# EAGLE schematic hawks_rov_1_controller_v2 (EAGLE 8.6.1)

## Sheet 1 of 7
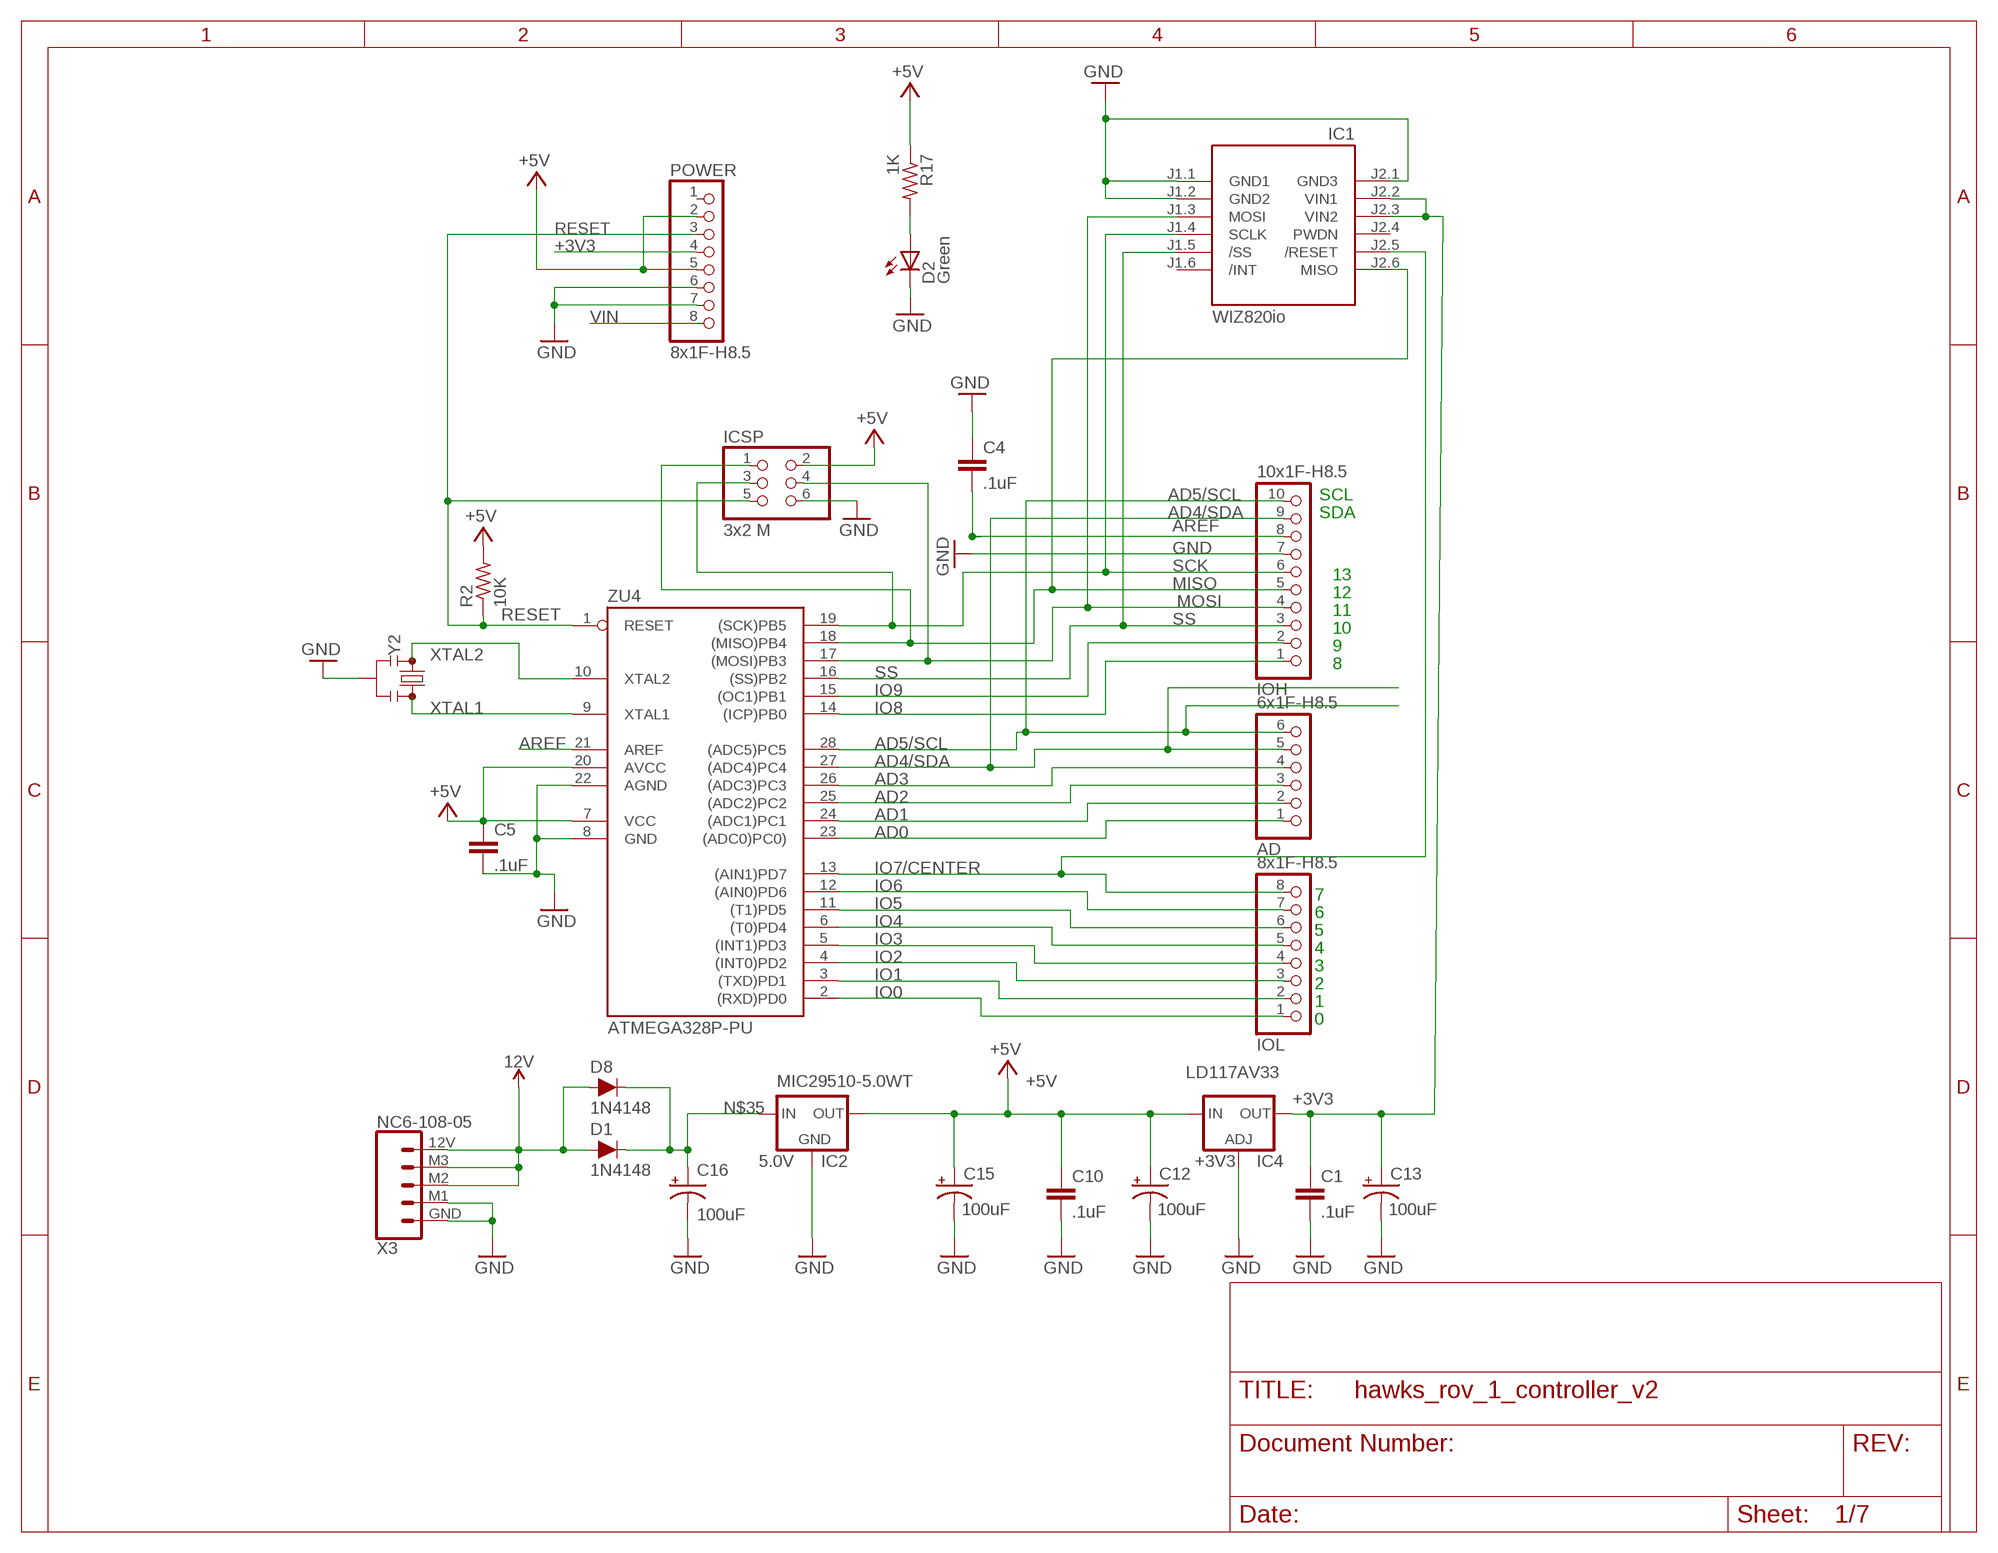
[diagram p0: schematic, sheet 1]

### Parts
AD  6x1F-H8.5  PINHD-1X6  [1X06]
C1  .1uF  10NF  [CAP-PTH-5MM]
C4  .1uF  10NF  [CAP-PTH-5MM]
C5  .1uF  10NF  [CAP-PTH-5MM]
C10  .1uF  10NF  [CAP-PTH-5MM]
C12  100uF  10UF-POLAR-RADIAL-2.5MM-25V-20%  [CPOL-RADIAL-2.5MM-5MM]
C13  100uF  10UF-POLAR-RADIAL-2.5MM-25V-20%  [CPOL-RADIAL-2.5MM-5MM]
C15  100uF  10UF-POLAR-RADIAL-2.5MM-25V-20%  [CPOL-RADIAL-2.5MM-5MM]
C16  100uF  10UF-POLAR-RADIAL-2.5MM-25V-20%  [CPOL-RADIAL-2.5MM-5MM]
D1  1N4148  DIODE-KIT  [DIODE-1N4148-KIT]
D2  Green  LED3MM  [LED3MM]
D8  1N4148  DIODE-KIT  [DIODE-1N4148-KIT]
IC1  WIZ820io  WIZ820IO_DEVICE'DUAL-IN-LINE'  [WIZ820IO]
IC4  LD117AV33  [TO220L1]
ICSP  3x2 M  PINHD-2X3  [2X03]
IOH  10x1F-H8.5  PINHD-1X10_ARD  [1X10]
IOL  8x1F-H8.5  PINHD-1X8  [1X08]
MIC29510-5.0WT  5.0V  MIC29510-5.0WT  [TO-220-STANDING]
POWER  8x1F-H8.5  PINHD-1X8  [1X08]
R2  10K  R-US_0207/10  [0207/10]
R17  1K  R-US_0207/10  [0207/10]
X3  NC6-108-05  [SCREWTERMINAL-3.5MM-5]
Y2  ZTT-16.00MX  [SIP3-UA]
ZU4  ATMEGA328P-PU  [DIL28-3]

### Nets
+3V3: C1.1 C13.1(+) IC1.J2.2(VIN1) IC1.J2.3(VIN2) IC4.2(OUT) POWER.4
+5V [usbvcc]: C5.1 C10.1 C12.1(+) C15.1(+) IC4.3(IN) ICSP.2 MIC29510-5.0WT.3(OUT) POWER.2 POWER.5 R2.2 R17.1 ZU4.7(VCC) ZU4.20(AVCC) ; also sheet 2,3,4,5,6,7
+12V: D1.A D8.A X3.12V X3.M2 X3.M3 ; supply symbol labelled 12V
AD0: AD.1 ZU4.23((ADC0)PC0))
AD1: AD.2 ZU4.24((ADC1)PC1)
AD2: AD.3 ZU4.25((ADC2)PC2)
AD3: AD.4 ZU4.26((ADC3)PC3)
AD4/SDA: AD.5 IOH.9 ZU4.27((ADC4)PC4) ; also sheet 2,3,4,5,6,7
AD5/SCL: AD.6 IOH.10 ZU4.28((ADC5)PC5) ; also sheet 2,3,4,5,6,7
AREF [aref]: C4.2 IOH.8 ZU4.21(AREF)
GND [gnd]: C1.2 C4.1 C5.2 C10.2 C12.2(-) C13.2(-) C15.2(-) C16.2(-) D2.K(C) IC1.J1.1(GND1) IC1.J1.2(GND2) IC1.J2.1(GND3) IC4.1(ADJ) ICSP.6 IOH.7 MIC29510-5.0WT.2(GND) POWER.6 POWER.7 X3.GND X3.M1 Y2.2 ZU4.8(GND) ZU4.22(AGND) ; also sheet 2,3,4,5,6,7
IO0: IOL.1 ZU4.2((RXD)PD0)
IO1: IOL.2 ZU4.3((TXD)PD1)
IO2: IOL.3 ZU4.4((INT0)PD2)
IO3: IOL.4 ZU4.5((INT1)PD3)
IO4: IOL.5 ZU4.6((T0)PD4)
IO5: IOL.6 ZU4.11((T1)PD5)
IO6: IOL.7 ZU4.12((AIN0)PD6)
IO7/CENTER: IC1.J2.5(/RESET) IOL.8 ZU4.13((AIN1)PD7)
IO8: IOH.1 ZU4.14((ICP)PB0)
IO9: IOH.2 ZU4.15((OC1)PB1)
MISO: IC1.J2.6(MISO) ICSP.1 IOH.5 ZU4.18((MISO)PB4)
MOSI: IC1.J1.3(MOSI) ICSP.4 IOH.4 ZU4.17((MOSI)PB3)
N$1: D2.A R17.2
N$35: C16.1(+) D1.C D8.C MIC29510-5.0WT.1(IN)
RESET: ICSP.5 POWER.3 R2.1 ZU4.1(RESET)
SCK: IC1.J1.4(SCLK) ICSP.3 IOH.6 ZU4.19((SCK)PB5)
SS: IC1.J1.5(/SS) IOH.3 ZU4.16((SS)PB2)
VIN [power]: POWER.8
XTAL1: Y2.3 ZU4.9(XTAL1)
XTAL2: Y2.1 ZU4.10(XTAL2)
Unconnected: IC1.J1.6(/INT) IC1.J2.4(PWDN) POWER.1

### Notes on the sheet
- SCL
- SDA
- 13
- 12
- 11
- 10
- 9
- 8
- 7
- 6
- 5
- 4
- 3
- 2
- 1
- 0

## Sheet 2 of 7
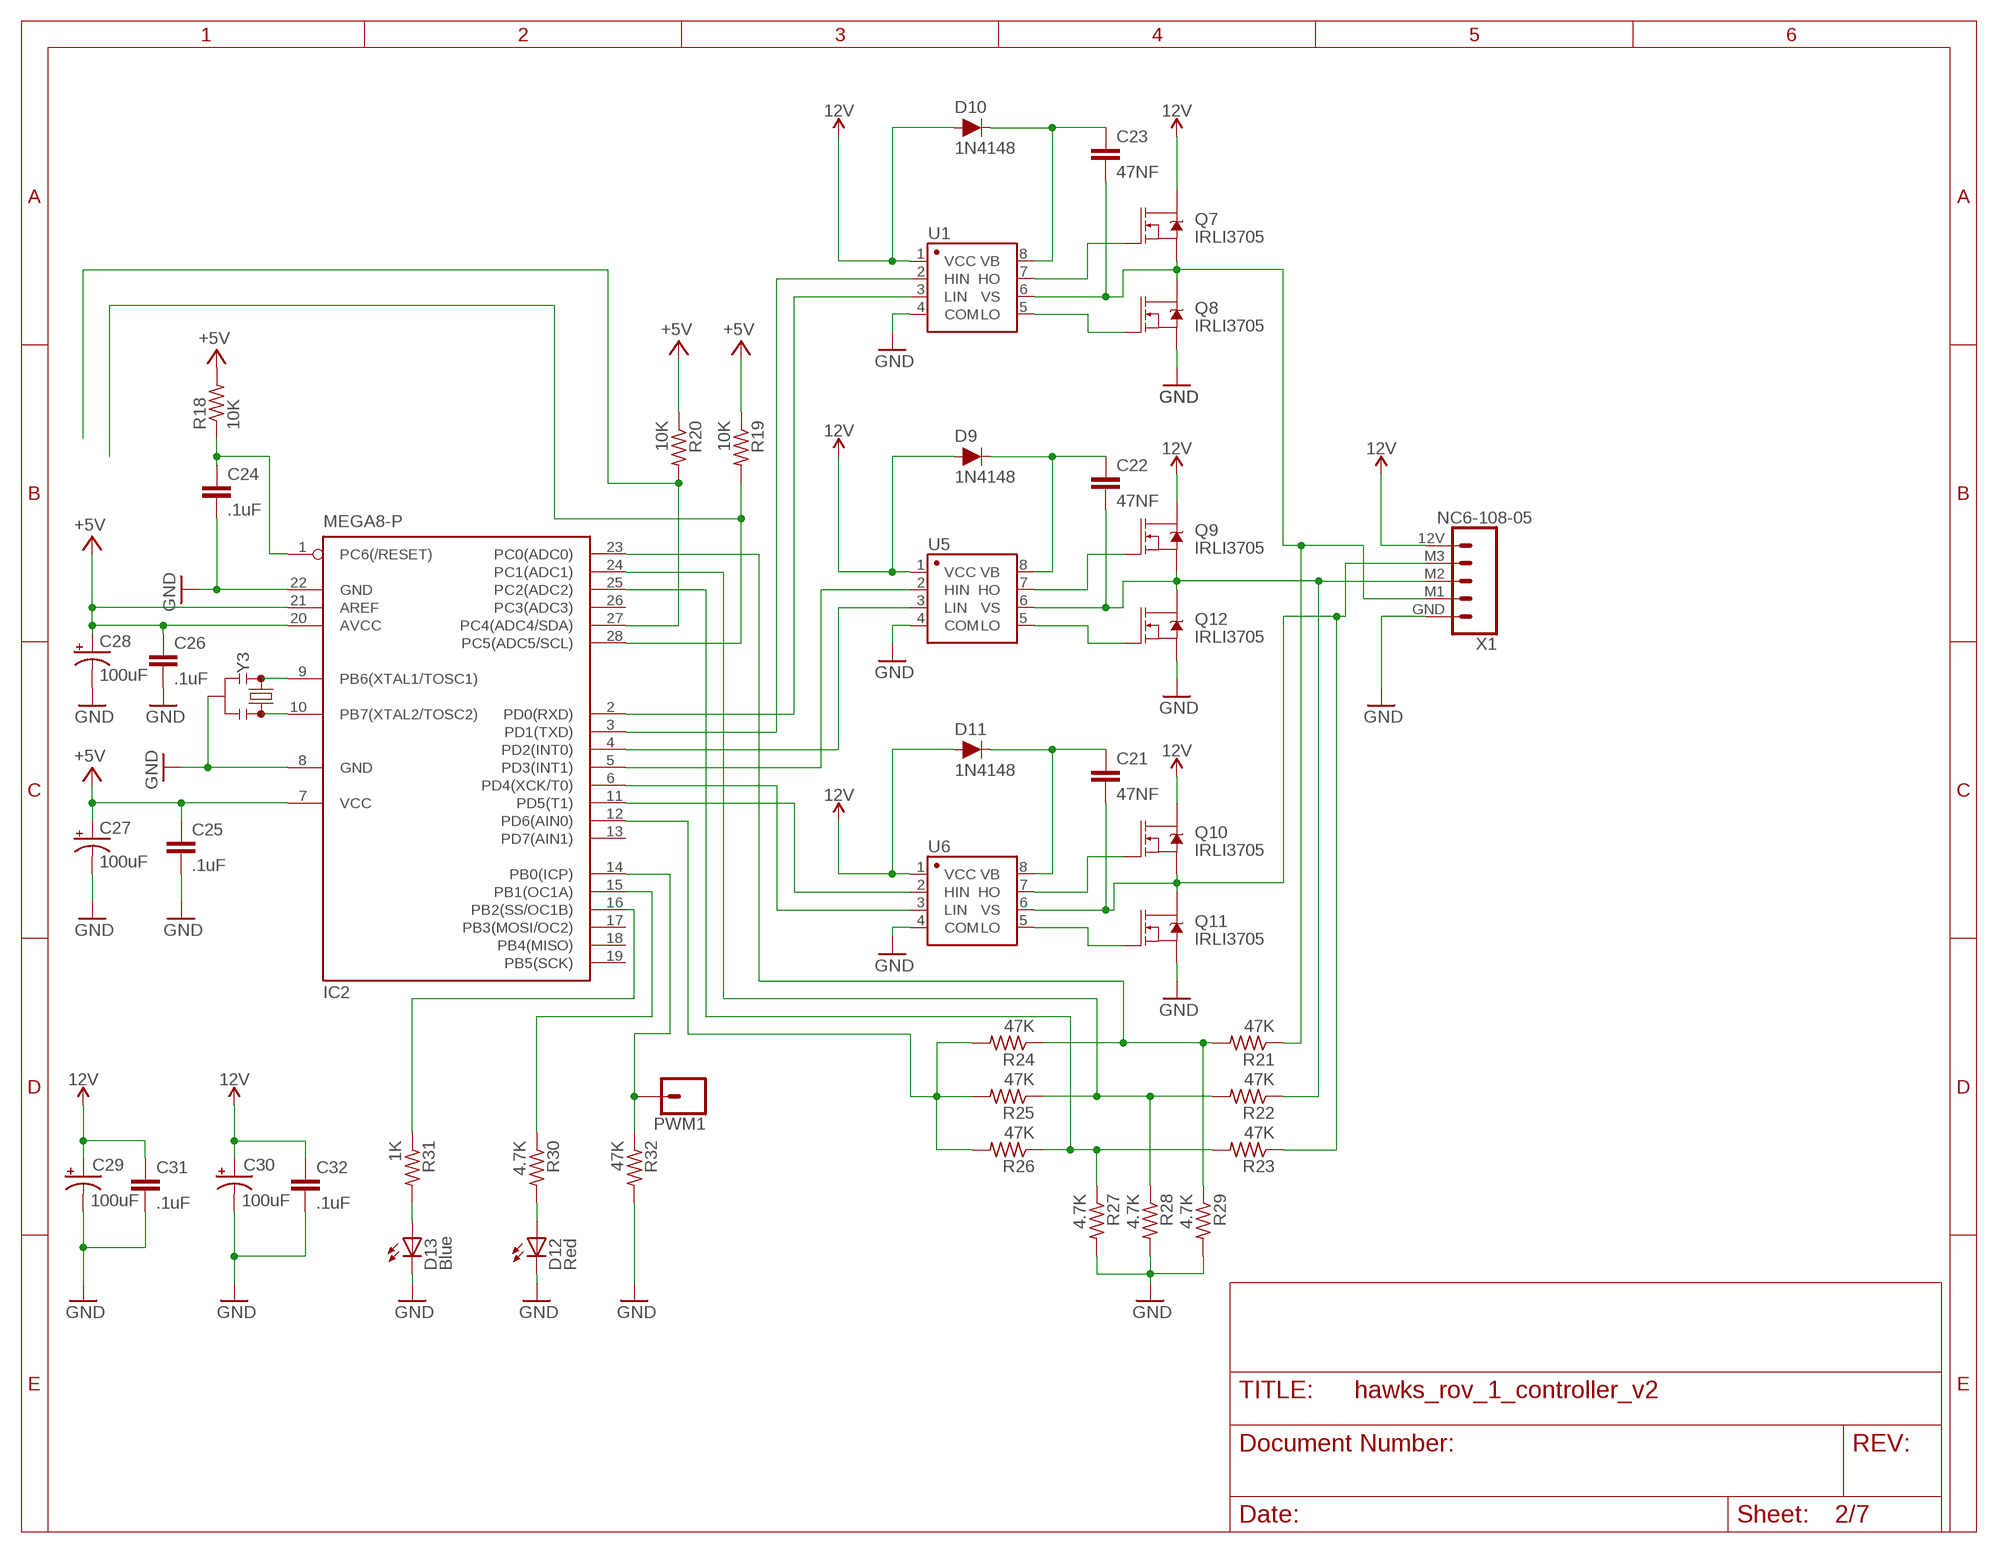
[diagram p1: schematic, sheet 2]

### Parts
C21  47NF  10NF  [CAP-PTH-5MM]
C22  47NF  10NF  [CAP-PTH-5MM]
C23  47NF  10NF  [CAP-PTH-5MM]
C24  .1uF  10NF  [CAP-PTH-5MM]
C25  .1uF  10NF  [CAP-PTH-5MM]
C26  .1uF  10NF  [CAP-PTH-5MM]
C27  100uF  10UF-POLAR-RADIAL-2.5MM-25V-20%  [CPOL-RADIAL-2.5MM-5MM]
C28  100uF  10UF-POLAR-RADIAL-2.5MM-25V-20%  [CPOL-RADIAL-2.5MM-5MM]
C29  100uF  10UF-POLAR-RADIAL-2.5MM-25V-20%  [CPOL-RADIAL-2.5MM-5MM]
C30  100uF  10UF-POLAR-RADIAL-2.5MM-25V-20%  [CPOL-RADIAL-2.5MM-5MM]
C31  .1uF  10NF  [CAP-PTH-5MM]
C32  .1uF  10NF  [CAP-PTH-5MM]
D9  1N4148  DIODE-KIT  [DIODE-1N4148-KIT]
D10  1N4148  DIODE-KIT  [DIODE-1N4148-KIT]
D11  1N4148  DIODE-KIT  [DIODE-1N4148-KIT]
D12  Red  LED3MM  [LED3MM]
D13  Blue  LED3MM  [LED3MM]
IC2  MEGA8-P  [DIL28-3]
PWM1  CONN_01  [1X01]
Q7  IRLI3705  MOSFET-NCH-FQP30N06L  [TO220V]
Q8  IRLI3705  MOSFET-NCH-FQP30N06L  [TO220V]
Q9  IRLI3705  MOSFET-NCH-FQP30N06L  [TO220V]
Q10  IRLI3705  MOSFET-NCH-FQP30N06L  [TO220V]
Q11  IRLI3705  MOSFET-NCH-FQP30N06L  [TO220V]
Q12  IRLI3705  MOSFET-NCH-FQP30N06L  [TO220V]
R18  10K  R-US_0207/10  [0207/10]
R19  10K  R-US_0207/10  [0207/10]
R20  10K  R-US_0207/10  [0207/10]
R21  47K  R-US_0207/10  [0207/10]
R22  47K  R-US_0207/10  [0207/10]
R23  47K  R-US_0207/10  [0207/10]
R24  47K  R-US_0207/10  [0207/10]
R25  47K  R-US_0207/10  [0207/10]
R26  47K  R-US_0207/10  [0207/10]
R27  4.7K  R-US_0207/10  [0207/10]
R28  4.7K  R-US_0207/10  [0207/10]
R29  4.7K  R-US_0207/10  [0207/10]
R30  4.7K  R-US_0207/10  [0207/10]
R31  1K  R-US_0207/10  [0207/10]
R32  47K  R-US_0207/10  [0207/10]
U1  IR2101PBF  [DIP-08]
U5  IR2101PBF  [DIP-08]
U6  IR2101PBF  [DIP-08]
X1  NC6-108-05  [SCREWTERMINAL-3.5MM-5]
Y3  ZTT-16.00MX  [SIP3-UA]

### Nets
12V: C29.1(+) C30.1(+) C31.1 C32.1 D9.A D10.A D11.A Q7.2(D) Q9.2(D) Q10.2(D) U1.1(VCC) U5.1(VCC) U6.1(VCC) X1.12V ; also sheet 3,4,5,6,7
+5V [usbvcc]: C25.1 C26.1 C27.1(+) C28.1(+) IC2.7(VCC) IC2.20(AVCC) IC2.21(AREF) R18.2 R19.1 R20.1 ; also sheet 1,3,4,5,6,7
AD4/SDA: IC2.27(PC4(ADC4/SDA)) R20.2 ; also sheet 1,3,4,5,6,7
AD5/SCL: IC2.28(PC5(ADC5/SCL)) R19.2 ; also sheet 1,3,4,5,6,7
GND [gnd]: C24.2 C25.2 C26.2 C27.2(-) C28.2(-) C29.2(-) C30.2(-) C31.2 C32.2 D12.K(C) D13.K(C) IC2.8(GND) IC2.22(GND) Q8.3(S) Q11.3(S) Q12.3(S) R27.2 R28.2 R29.2 R32.2 U1.4(COM) U5.4(COM) U6.4(COM) X1.GND Y3.2 ; also sheet 1,3,4,5,6,7
N$37: IC2.3(PD1(TXD)) U1.2(HIN)
N$38: IC2.2(PD0(RXD)) U1.3(LIN)
N$39: IC2.5(PD3(INT1)) U5.2(HIN)
N$40: IC2.4(PD2(INT0)) U5.3(LIN)
N$41: IC2.11(PD5(T1)) U6.2(HIN)
N$42: IC2.6(PD4(XCK/T0)) U6.3(LIN)
N$43: Q7.1(G) U1.7(HO)
N$44: Q8.1(G) U1.5(LO)
N$45: Q9.1(G) U5.7(HO)
N$46: Q12.1(G) U5.5(LO)
N$47: Q10.1(G) U6.7(HO)
N$48: Q11.1(G) U6.5(LO)
N$49: C22.1 D9.C U5.8(VB)
N$50: C23.1 D10.C U1.8(VB)
N$51: C21.1 D11.C U6.8(VB)
N$52: IC2.23(PC0(ADC0)) R21.2 R24.1 R29.1
N$53: IC2.24(PC1(ADC1)) R22.2 R25.1 R28.1
N$54: IC2.25(PC2(ADC2)) R23.2 R26.1 R27.1
N$55: C21.2 Q10.3(S) Q11.2(D) R23.1 U6.6(VS) X1.M3
N$56: C22.2 Q9.3(S) Q12.2(D) R22.1 U5.6(VS) X1.M2
N$57: C23.2 Q7.3(S) Q8.2(D) R21.1 U1.6(VS) X1.M1
N$58: IC2.12(PD6(AIN0)) R24.2 R25.2 R26.2
N$59: IC2.9(PB6(XTAL1/TOSC1)) Y3.1
N$60: IC2.10(PB7(XTAL2/TOSC2)) Y3.3
N$61: D12.A R30.2
N$62: D13.A R31.2
N$63: IC2.15(PB1(OC1A)) R30.1
N$64: IC2.16(PB2(SS/OC1B)) R31.1
N$65: C24.1 IC2.1(PC6(/RESET)) R18.1
N$66: IC2.14(PB0(ICP)) PWM1.1 R32.1
Unconnected: IC2.13(PD7(AIN1)) IC2.17(PB3(MOSI/OC2)) IC2.18(PB4(MISO)) IC2.19(PB5(SCK)) IC2.26(PC3(ADC3))

## Sheet 3 of 7
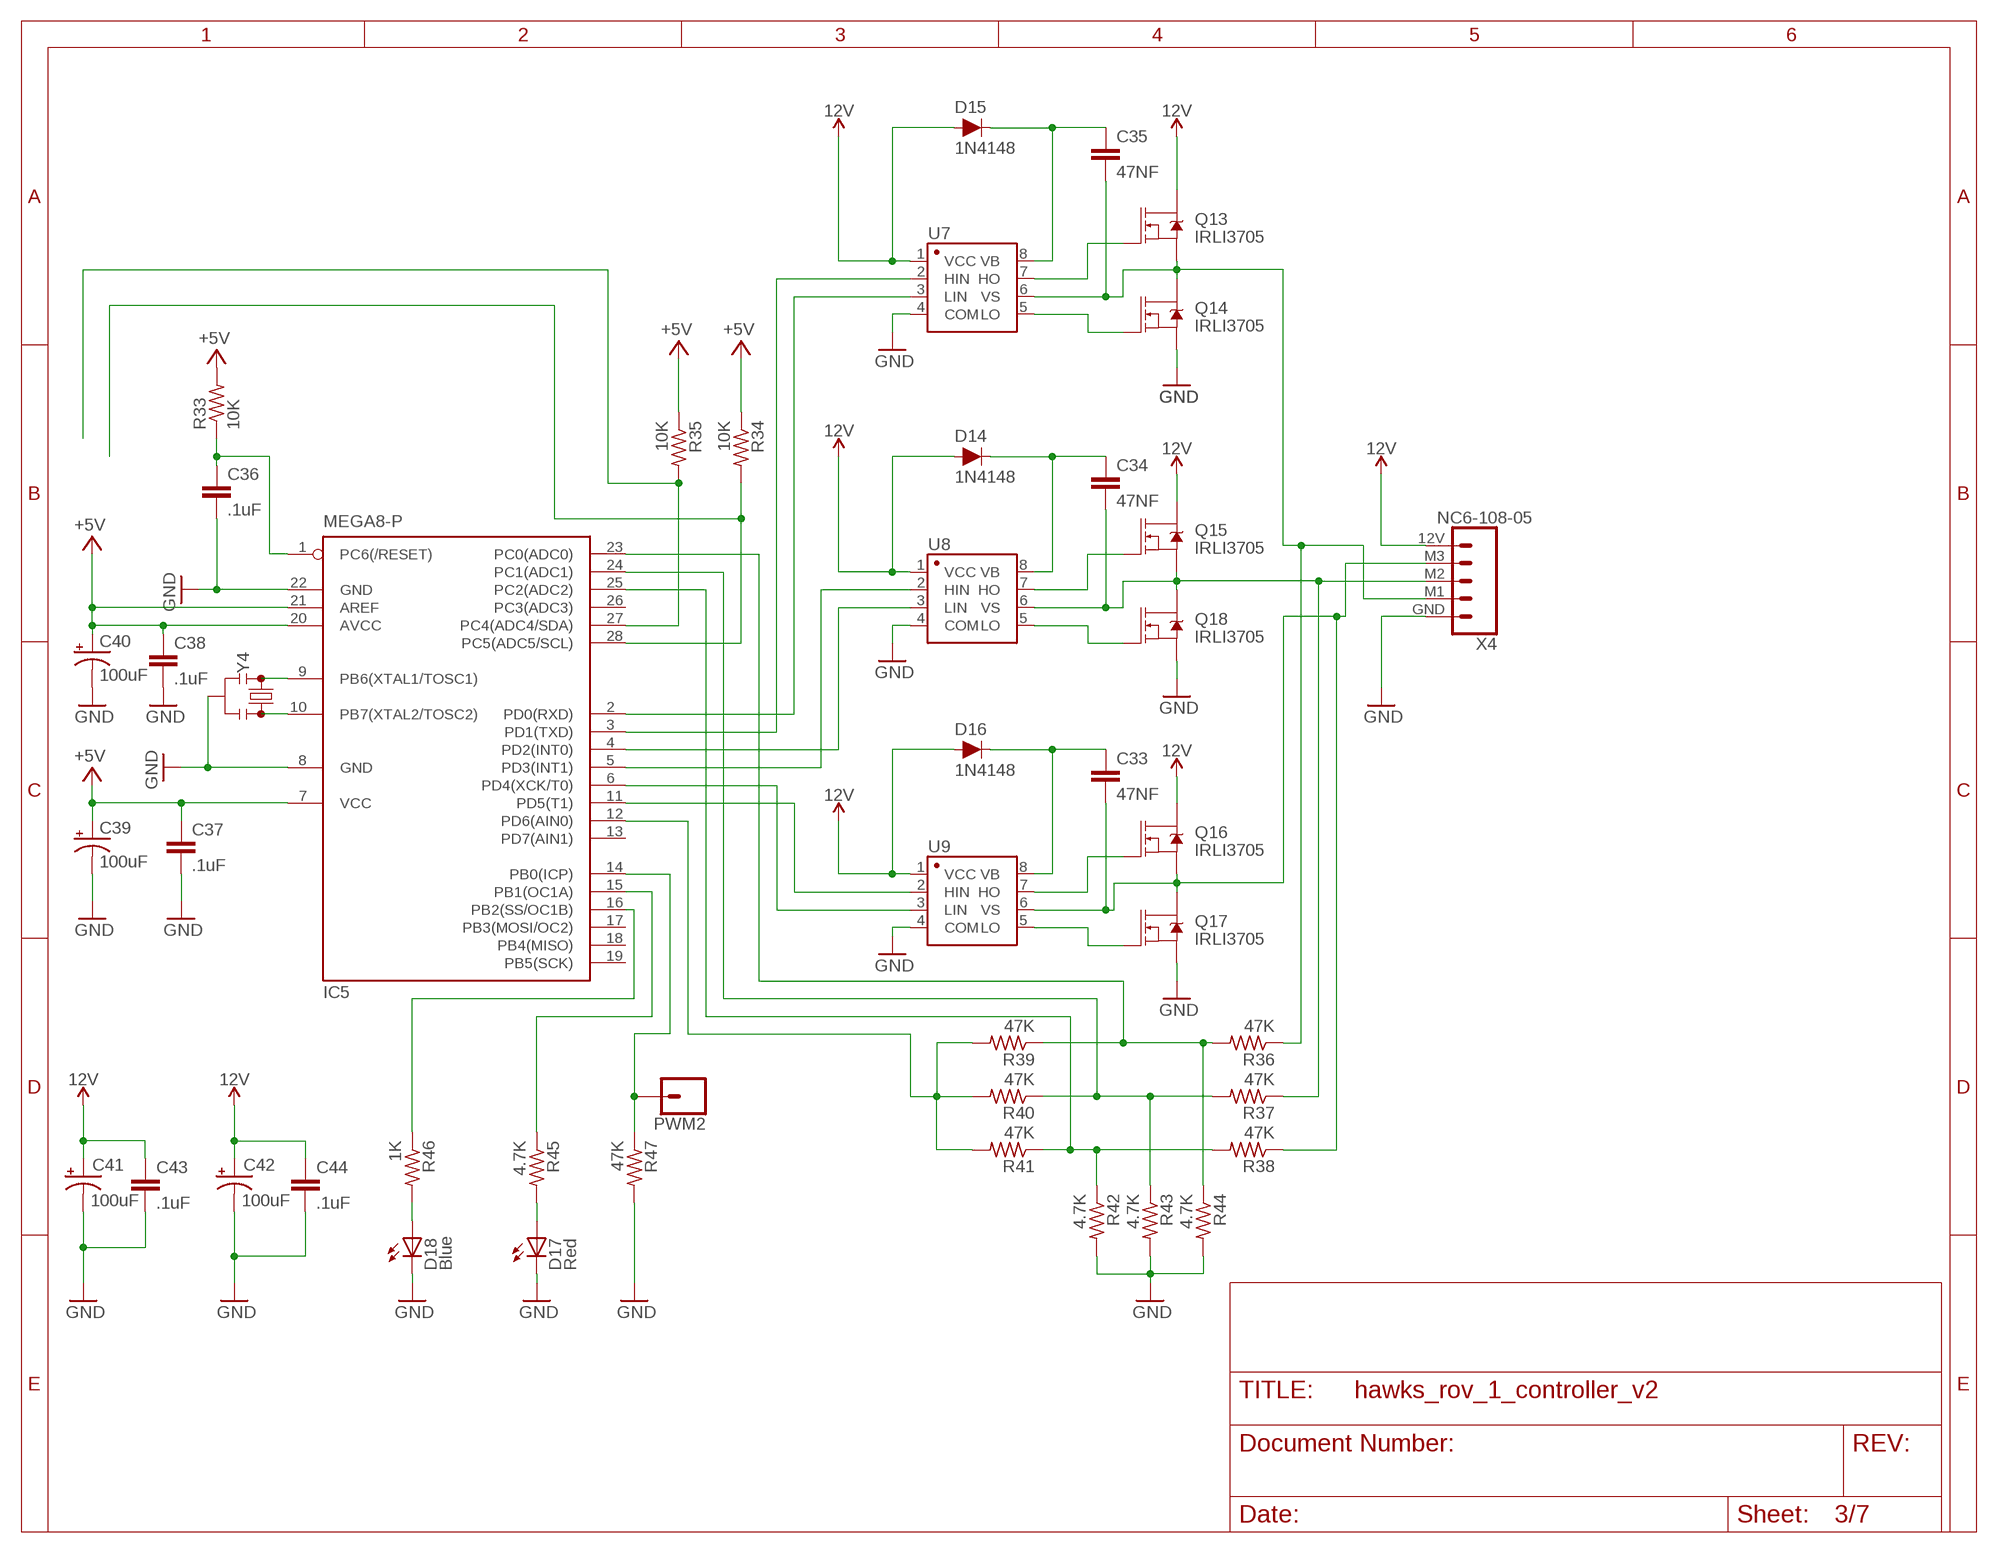
[diagram p2: schematic, sheet 3]

### Parts
C33  47NF  10NF  [CAP-PTH-5MM]
C34  47NF  10NF  [CAP-PTH-5MM]
C35  47NF  10NF  [CAP-PTH-5MM]
C36  .1uF  10NF  [CAP-PTH-5MM]
C37  .1uF  10NF  [CAP-PTH-5MM]
C38  .1uF  10NF  [CAP-PTH-5MM]
C39  100uF  10UF-POLAR-RADIAL-2.5MM-25V-20%  [CPOL-RADIAL-2.5MM-5MM]
C40  100uF  10UF-POLAR-RADIAL-2.5MM-25V-20%  [CPOL-RADIAL-2.5MM-5MM]
C41  100uF  10UF-POLAR-RADIAL-2.5MM-25V-20%  [CPOL-RADIAL-2.5MM-5MM]
C42  100uF  10UF-POLAR-RADIAL-2.5MM-25V-20%  [CPOL-RADIAL-2.5MM-5MM]
C43  .1uF  10NF  [CAP-PTH-5MM]
C44  .1uF  10NF  [CAP-PTH-5MM]
D14  1N4148  DIODE-KIT  [DIODE-1N4148-KIT]
D15  1N4148  DIODE-KIT  [DIODE-1N4148-KIT]
D16  1N4148  DIODE-KIT  [DIODE-1N4148-KIT]
D17  Red  LED3MM  [LED3MM]
D18  Blue  LED3MM  [LED3MM]
IC5  MEGA8-P  [DIL28-3]
PWM2  CONN_01  [1X01]
Q13  IRLI3705  MOSFET-NCH-FQP30N06L  [TO220V]
Q14  IRLI3705  MOSFET-NCH-FQP30N06L  [TO220V]
Q15  IRLI3705  MOSFET-NCH-FQP30N06L  [TO220V]
Q16  IRLI3705  MOSFET-NCH-FQP30N06L  [TO220V]
Q17  IRLI3705  MOSFET-NCH-FQP30N06L  [TO220V]
Q18  IRLI3705  MOSFET-NCH-FQP30N06L  [TO220V]
R33  10K  R-US_0207/10  [0207/10]
R34  10K  R-US_0207/10  [0207/10]
R35  10K  R-US_0207/10  [0207/10]
R36  47K  R-US_0207/10  [0207/10]
R37  47K  R-US_0207/10  [0207/10]
R38  47K  R-US_0207/10  [0207/10]
R39  47K  R-US_0207/10  [0207/10]
R40  47K  R-US_0207/10  [0207/10]
R41  47K  R-US_0207/10  [0207/10]
R42  4.7K  R-US_0207/10  [0207/10]
R43  4.7K  R-US_0207/10  [0207/10]
R44  4.7K  R-US_0207/10  [0207/10]
R45  4.7K  R-US_0207/10  [0207/10]
R46  1K  R-US_0207/10  [0207/10]
R47  47K  R-US_0207/10  [0207/10]
U7  IR2101PBF  [DIP-08]
U8  IR2101PBF  [DIP-08]
U9  IR2101PBF  [DIP-08]
X4  NC6-108-05  [SCREWTERMINAL-3.5MM-5]
Y4  ZTT-16.00MX  [SIP3-UA]

### Nets
12V: C41.1(+) C42.1(+) C43.1 C44.1 D14.A D15.A D16.A Q13.2(D) Q15.2(D) Q16.2(D) U7.1(VCC) U8.1(VCC) U9.1(VCC) X4.12V ; also sheet 2,4,5,6,7
+5V [usbvcc]: C37.1 C38.1 C39.1(+) C40.1(+) IC5.7(VCC) IC5.20(AVCC) IC5.21(AREF) R33.2 R34.1 R35.1 ; also sheet 1,2,4,5,6,7
AD4/SDA: IC5.27(PC4(ADC4/SDA)) R35.2 ; also sheet 1,2,4,5,6,7
AD5/SCL: IC5.28(PC5(ADC5/SCL)) R34.2 ; also sheet 1,2,4,5,6,7
GND [gnd]: C36.2 C37.2 C38.2 C39.2(-) C40.2(-) C41.2(-) C42.2(-) C43.2 C44.2 D17.K(C) D18.K(C) IC5.8(GND) IC5.22(GND) Q14.3(S) Q17.3(S) Q18.3(S) R42.2 R43.2 R44.2 R47.2 U7.4(COM) U8.4(COM) U9.4(COM) X4.GND Y4.2 ; also sheet 1,2,4,5,6,7
N$67: IC5.3(PD1(TXD)) U7.2(HIN)
N$68: IC5.2(PD0(RXD)) U7.3(LIN)
N$69: IC5.5(PD3(INT1)) U8.2(HIN)
N$70: IC5.4(PD2(INT0)) U8.3(LIN)
N$71: IC5.11(PD5(T1)) U9.2(HIN)
N$72: IC5.6(PD4(XCK/T0)) U9.3(LIN)
N$73: Q13.1(G) U7.7(HO)
N$74: Q14.1(G) U7.5(LO)
N$75: Q15.1(G) U8.7(HO)
N$76: Q18.1(G) U8.5(LO)
N$77: Q16.1(G) U9.7(HO)
N$78: Q17.1(G) U9.5(LO)
N$79: C34.1 D14.C U8.8(VB)
N$80: C35.1 D15.C U7.8(VB)
N$81: C33.1 D16.C U9.8(VB)
N$82: IC5.23(PC0(ADC0)) R36.2 R39.1 R44.1
N$83: IC5.24(PC1(ADC1)) R37.2 R40.1 R43.1
N$84: IC5.25(PC2(ADC2)) R38.2 R41.1 R42.1
N$85: C33.2 Q16.3(S) Q17.2(D) R38.1 U9.6(VS) X4.M3
N$86: C34.2 Q15.3(S) Q18.2(D) R37.1 U8.6(VS) X4.M2
N$87: C35.2 Q13.3(S) Q14.2(D) R36.1 U7.6(VS) X4.M1
N$88: IC5.12(PD6(AIN0)) R39.2 R40.2 R41.2
N$89: IC5.9(PB6(XTAL1/TOSC1)) Y4.1
N$90: IC5.10(PB7(XTAL2/TOSC2)) Y4.3
N$91: D17.A R45.2
N$92: D18.A R46.2
N$93: IC5.15(PB1(OC1A)) R45.1
N$94: IC5.16(PB2(SS/OC1B)) R46.1
N$95: C36.1 IC5.1(PC6(/RESET)) R33.1
N$96: IC5.14(PB0(ICP)) PWM2.1 R47.1
Unconnected: IC5.13(PD7(AIN1)) IC5.17(PB3(MOSI/OC2)) IC5.18(PB4(MISO)) IC5.19(PB5(SCK)) IC5.26(PC3(ADC3))

## Sheet 4 of 7
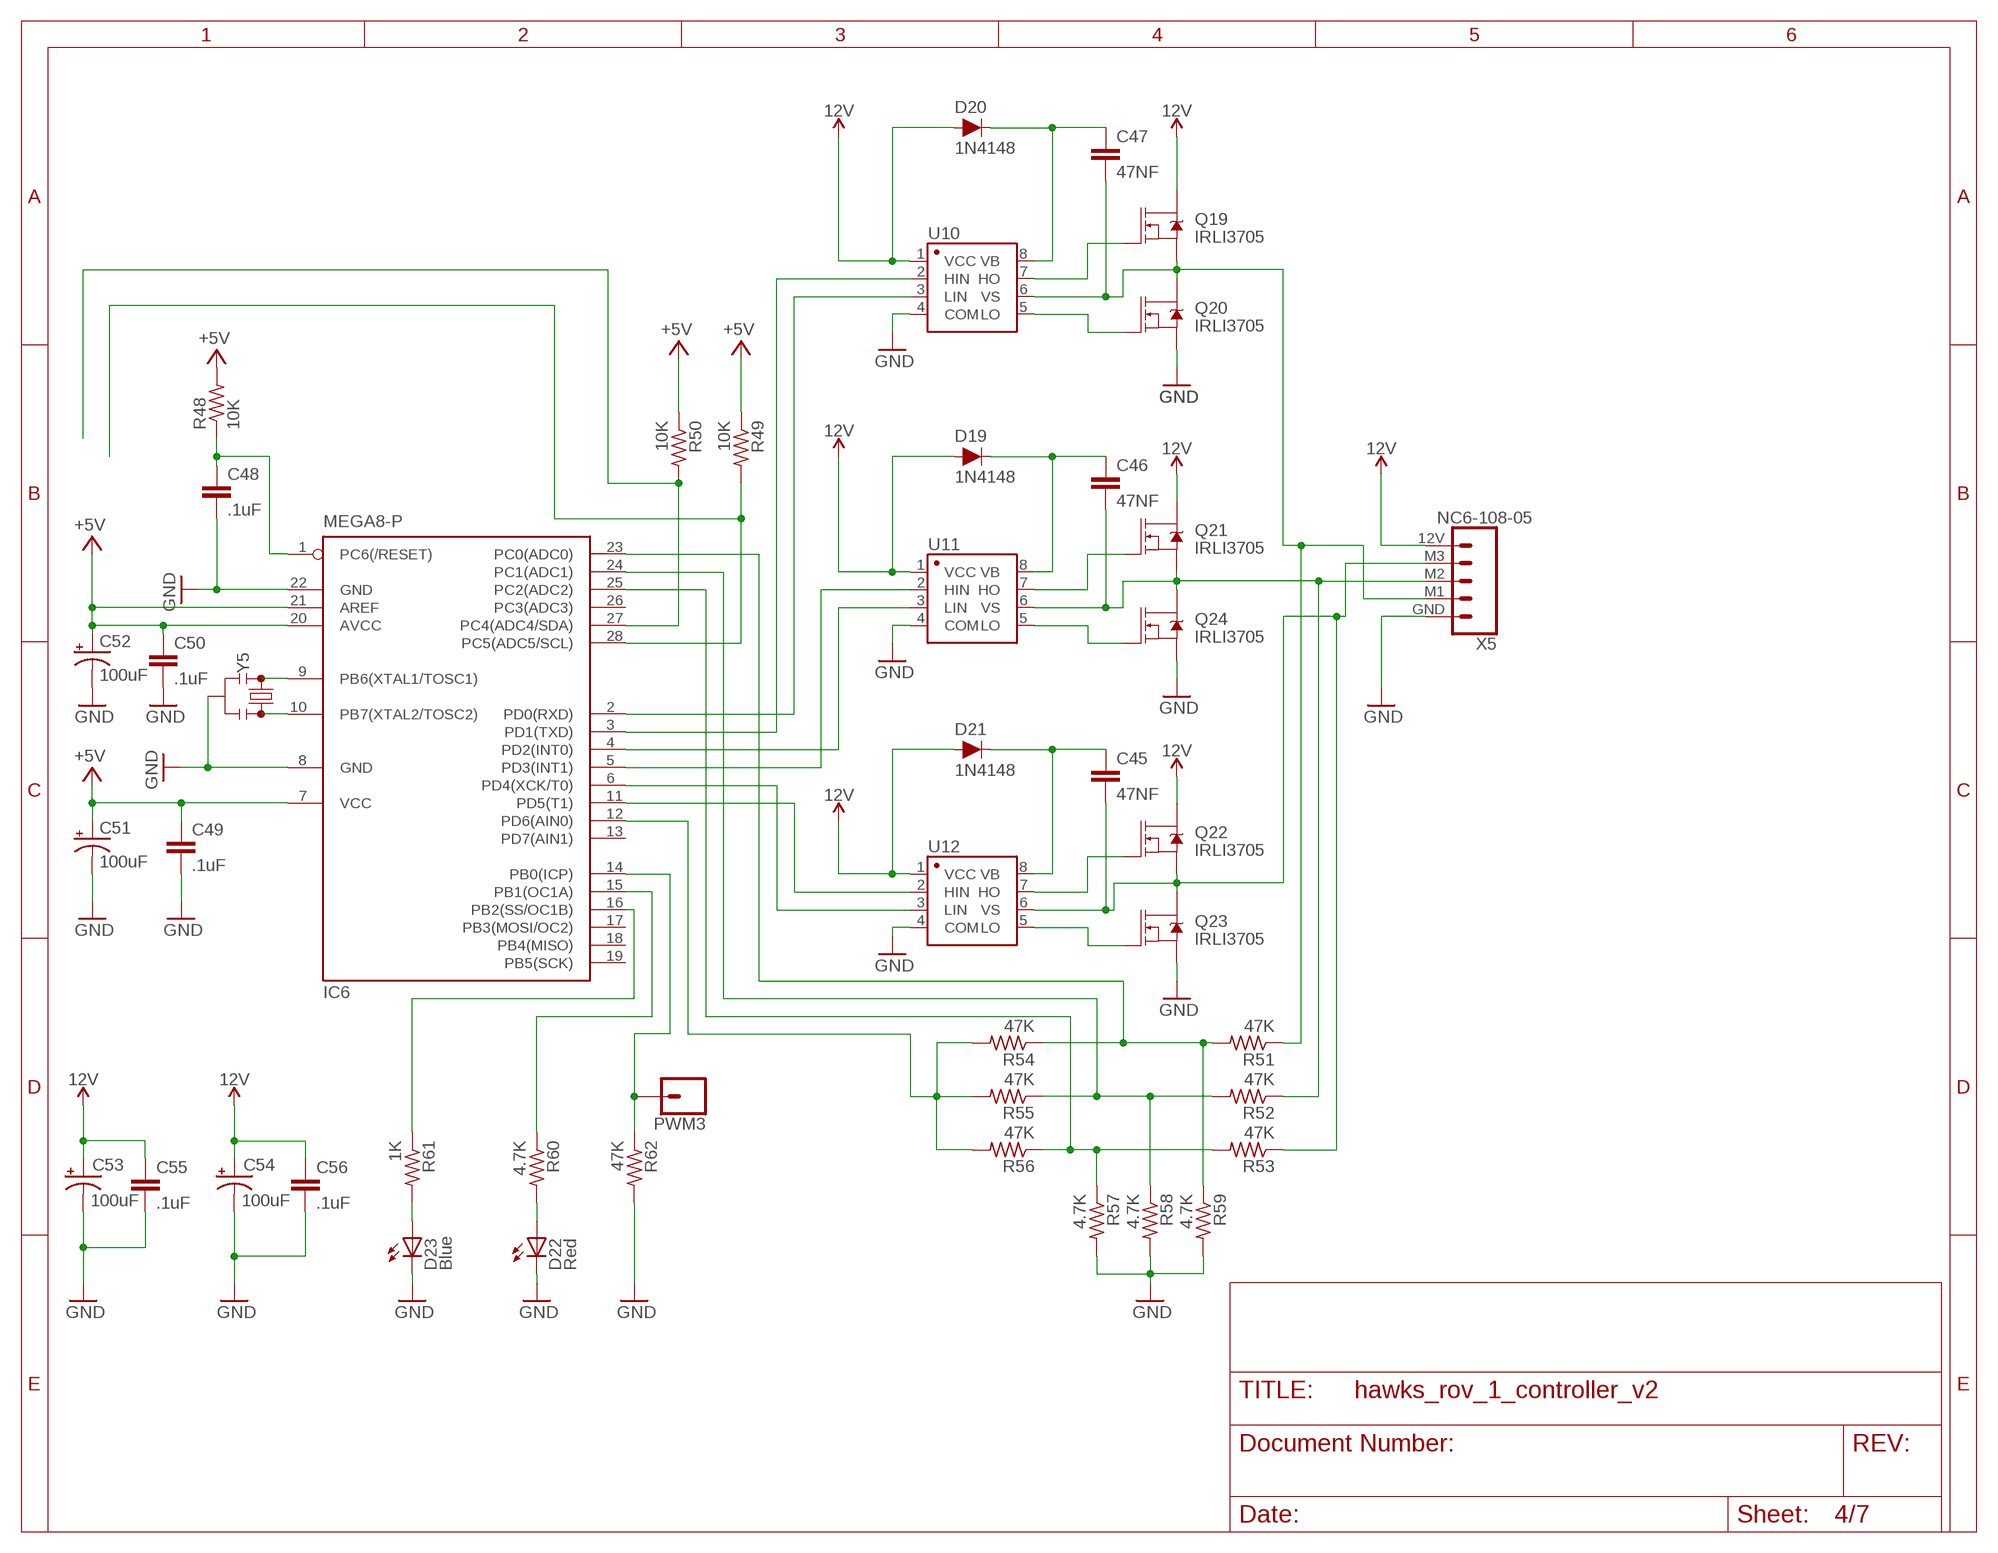
[diagram p3: schematic, sheet 4]

### Parts
C45  47NF  10NF  [CAP-PTH-5MM]
C46  47NF  10NF  [CAP-PTH-5MM]
C47  47NF  10NF  [CAP-PTH-5MM]
C48  .1uF  10NF  [CAP-PTH-5MM]
C49  .1uF  10NF  [CAP-PTH-5MM]
C50  .1uF  10NF  [CAP-PTH-5MM]
C51  100uF  10UF-POLAR-RADIAL-2.5MM-25V-20%  [CPOL-RADIAL-2.5MM-5MM]
C52  100uF  10UF-POLAR-RADIAL-2.5MM-25V-20%  [CPOL-RADIAL-2.5MM-5MM]
C53  100uF  10UF-POLAR-RADIAL-2.5MM-25V-20%  [CPOL-RADIAL-2.5MM-5MM]
C54  100uF  10UF-POLAR-RADIAL-2.5MM-25V-20%  [CPOL-RADIAL-2.5MM-5MM]
C55  .1uF  10NF  [CAP-PTH-5MM]
C56  .1uF  10NF  [CAP-PTH-5MM]
D19  1N4148  DIODE-KIT  [DIODE-1N4148-KIT]
D20  1N4148  DIODE-KIT  [DIODE-1N4148-KIT]
D21  1N4148  DIODE-KIT  [DIODE-1N4148-KIT]
D22  Red  LED3MM  [LED3MM]
D23  Blue  LED3MM  [LED3MM]
IC6  MEGA8-P  [DIL28-3]
PWM3  CONN_01  [1X01]
Q19  IRLI3705  MOSFET-NCH-FQP30N06L  [TO220V]
Q20  IRLI3705  MOSFET-NCH-FQP30N06L  [TO220V]
Q21  IRLI3705  MOSFET-NCH-FQP30N06L  [TO220V]
Q22  IRLI3705  MOSFET-NCH-FQP30N06L  [TO220V]
Q23  IRLI3705  MOSFET-NCH-FQP30N06L  [TO220V]
Q24  IRLI3705  MOSFET-NCH-FQP30N06L  [TO220V]
R48  10K  R-US_0207/10  [0207/10]
R49  10K  R-US_0207/10  [0207/10]
R50  10K  R-US_0207/10  [0207/10]
R51  47K  R-US_0207/10  [0207/10]
R52  47K  R-US_0207/10  [0207/10]
R53  47K  R-US_0207/10  [0207/10]
R54  47K  R-US_0207/10  [0207/10]
R55  47K  R-US_0207/10  [0207/10]
R56  47K  R-US_0207/10  [0207/10]
R57  4.7K  R-US_0207/10  [0207/10]
R58  4.7K  R-US_0207/10  [0207/10]
R59  4.7K  R-US_0207/10  [0207/10]
R60  4.7K  R-US_0207/10  [0207/10]
R61  1K  R-US_0207/10  [0207/10]
R62  47K  R-US_0207/10  [0207/10]
U10  IR2101PBF  [DIP-08]
U11  IR2101PBF  [DIP-08]
U12  IR2101PBF  [DIP-08]
X5  NC6-108-05  [SCREWTERMINAL-3.5MM-5]
Y5  ZTT-16.00MX  [SIP3-UA]

### Nets
12V: C53.1(+) C54.1(+) C55.1 C56.1 D19.A D20.A D21.A Q19.2(D) Q21.2(D) Q22.2(D) U10.1(VCC) U11.1(VCC) U12.1(VCC) X5.12V ; also sheet 2,3,5,6,7
+5V [usbvcc]: C49.1 C50.1 C51.1(+) C52.1(+) IC6.7(VCC) IC6.20(AVCC) IC6.21(AREF) R48.2 R49.1 R50.1 ; also sheet 1,2,3,5,6,7
AD4/SDA: IC6.27(PC4(ADC4/SDA)) R50.2 ; also sheet 1,2,3,5,6,7
AD5/SCL: IC6.28(PC5(ADC5/SCL)) R49.2 ; also sheet 1,2,3,5,6,7
GND [gnd]: C48.2 C49.2 C50.2 C51.2(-) C52.2(-) C53.2(-) C54.2(-) C55.2 C56.2 D22.K(C) D23.K(C) IC6.8(GND) IC6.22(GND) Q20.3(S) Q23.3(S) Q24.3(S) R57.2 R58.2 R59.2 R62.2 U10.4(COM) U11.4(COM) U12.4(COM) X5.GND Y5.2 ; also sheet 1,2,3,5,6,7
N$97: IC6.3(PD1(TXD)) U10.2(HIN)
N$98: IC6.2(PD0(RXD)) U10.3(LIN)
N$99: IC6.5(PD3(INT1)) U11.2(HIN)
N$100: IC6.4(PD2(INT0)) U11.3(LIN)
N$101: IC6.11(PD5(T1)) U12.2(HIN)
N$102: IC6.6(PD4(XCK/T0)) U12.3(LIN)
N$103: Q19.1(G) U10.7(HO)
N$104: Q20.1(G) U10.5(LO)
N$105: Q21.1(G) U11.7(HO)
N$106: Q24.1(G) U11.5(LO)
N$107: Q22.1(G) U12.7(HO)
N$108: Q23.1(G) U12.5(LO)
N$109: C46.1 D19.C U11.8(VB)
N$110: C47.1 D20.C U10.8(VB)
N$111: C45.1 D21.C U12.8(VB)
N$112: IC6.23(PC0(ADC0)) R51.2 R54.1 R59.1
N$113: IC6.24(PC1(ADC1)) R52.2 R55.1 R58.1
N$114: IC6.25(PC2(ADC2)) R53.2 R56.1 R57.1
N$115: C45.2 Q22.3(S) Q23.2(D) R53.1 U12.6(VS) X5.M3
N$116: C46.2 Q21.3(S) Q24.2(D) R52.1 U11.6(VS) X5.M2
N$117: C47.2 Q19.3(S) Q20.2(D) R51.1 U10.6(VS) X5.M1
N$118: IC6.12(PD6(AIN0)) R54.2 R55.2 R56.2
N$119: IC6.9(PB6(XTAL1/TOSC1)) Y5.1
N$120: IC6.10(PB7(XTAL2/TOSC2)) Y5.3
N$121: D22.A R60.2
N$122: D23.A R61.2
N$123: IC6.15(PB1(OC1A)) R60.1
N$124: IC6.16(PB2(SS/OC1B)) R61.1
N$125: C48.1 IC6.1(PC6(/RESET)) R48.1
N$126: IC6.14(PB0(ICP)) PWM3.1 R62.1
Unconnected: IC6.13(PD7(AIN1)) IC6.17(PB3(MOSI/OC2)) IC6.18(PB4(MISO)) IC6.19(PB5(SCK)) IC6.26(PC3(ADC3))

## Sheet 5 of 7
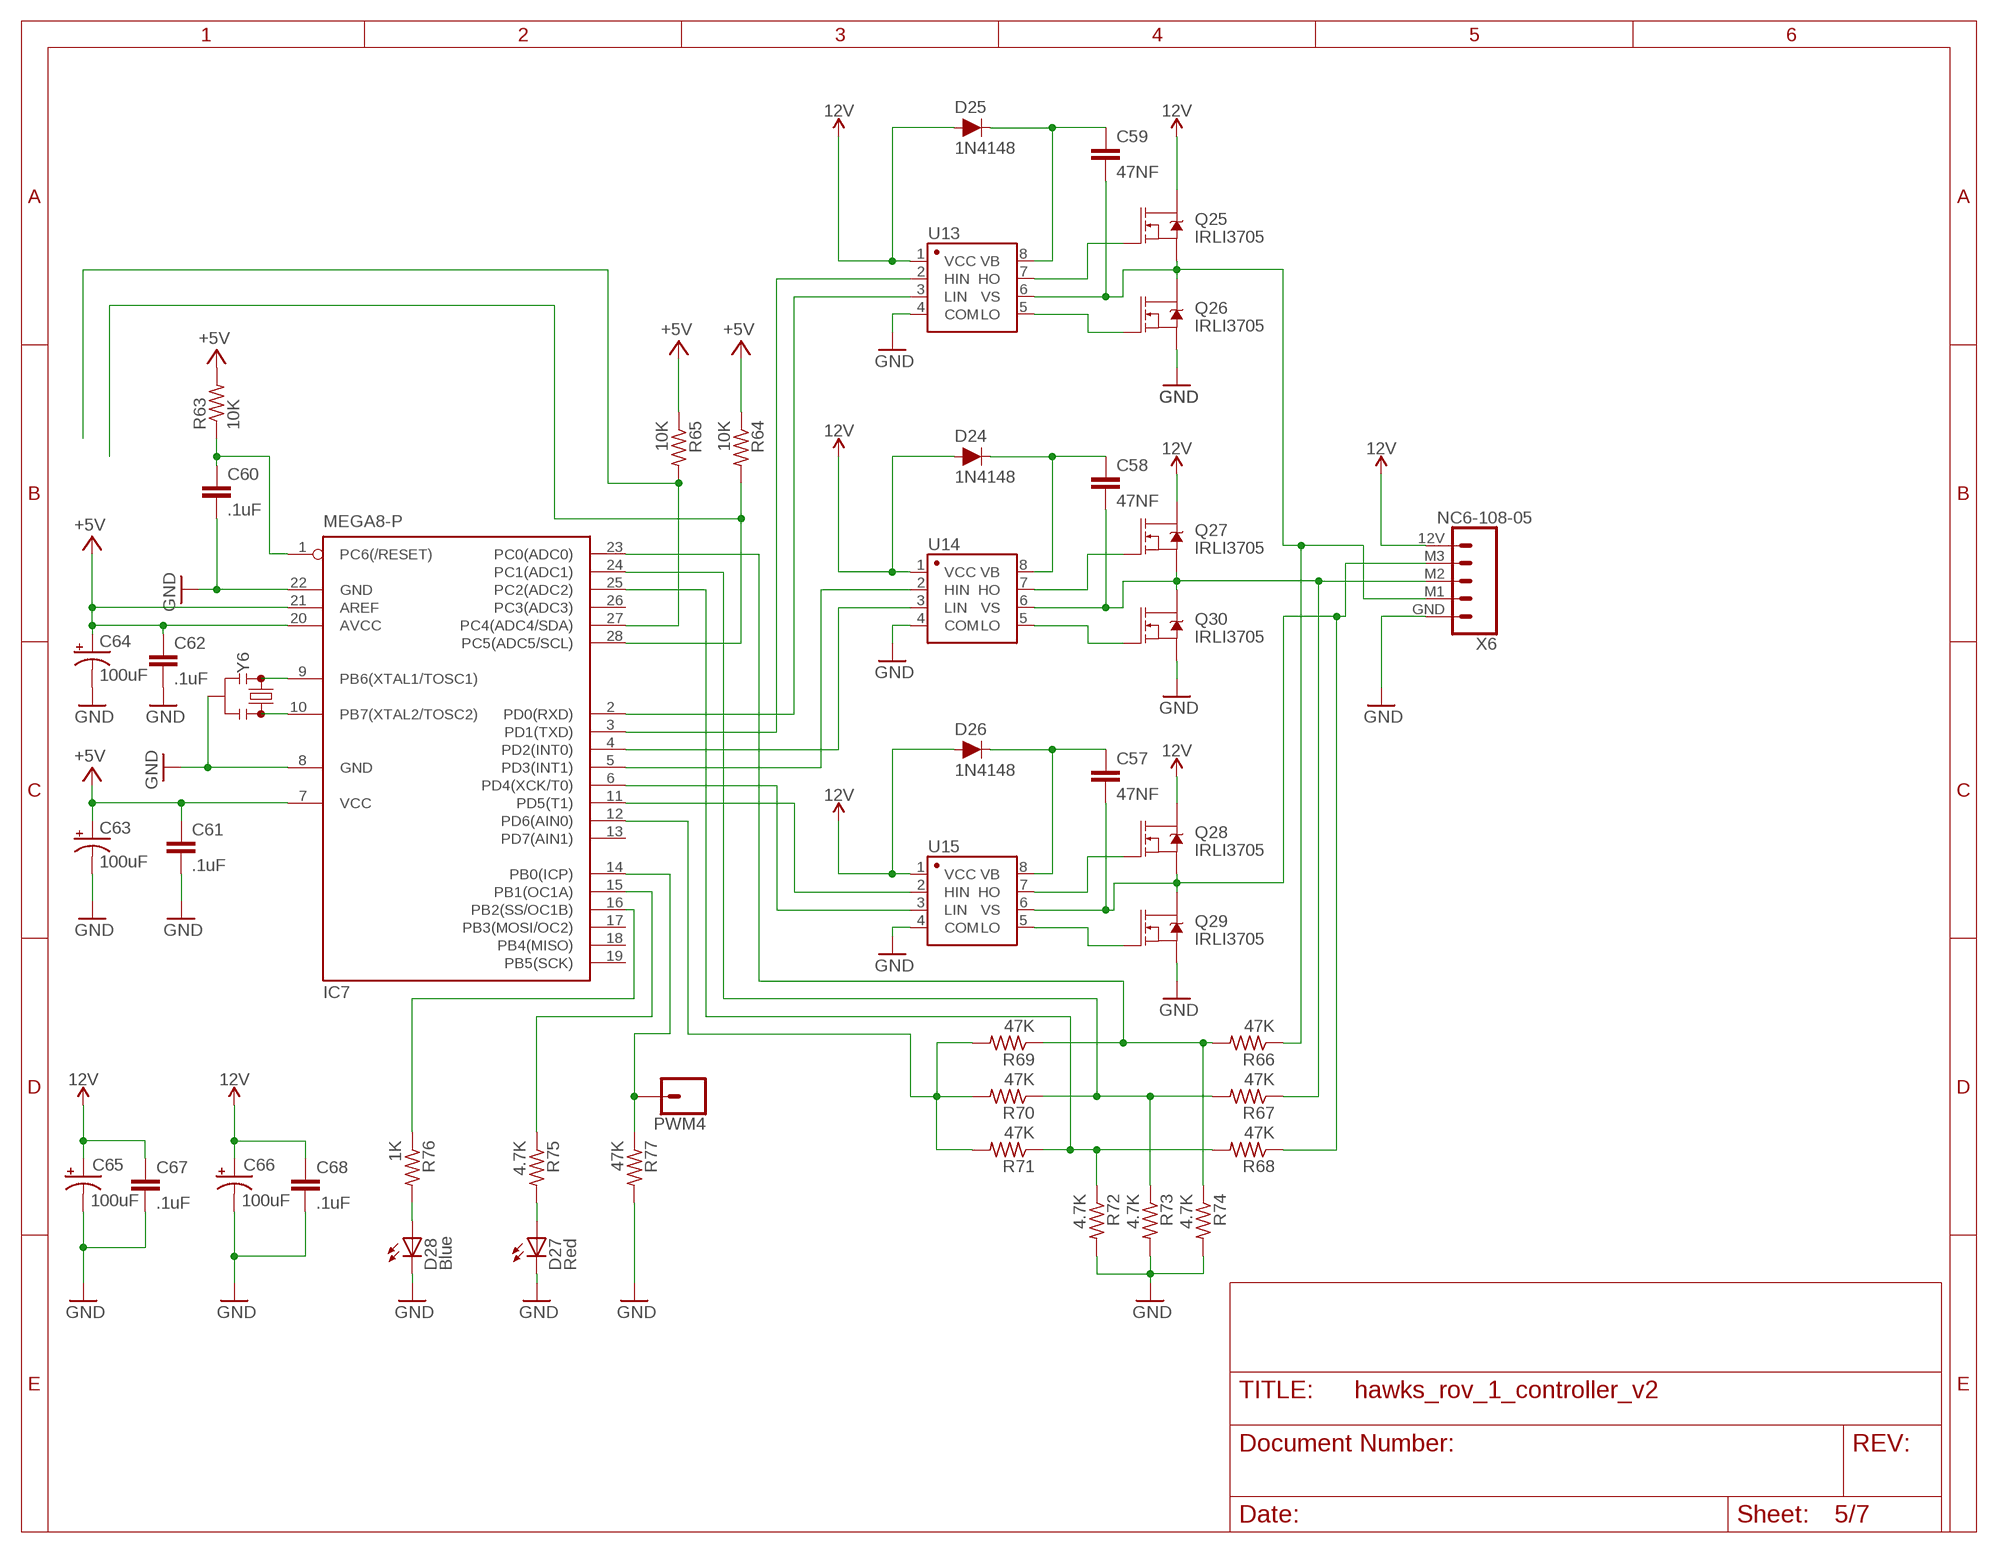
[diagram p4: schematic, sheet 5]

### Parts
C57  47NF  10NF  [CAP-PTH-5MM]
C58  47NF  10NF  [CAP-PTH-5MM]
C59  47NF  10NF  [CAP-PTH-5MM]
C60  .1uF  10NF  [CAP-PTH-5MM]
C61  .1uF  10NF  [CAP-PTH-5MM]
C62  .1uF  10NF  [CAP-PTH-5MM]
C63  100uF  10UF-POLAR-RADIAL-2.5MM-25V-20%  [CPOL-RADIAL-2.5MM-5MM]
C64  100uF  10UF-POLAR-RADIAL-2.5MM-25V-20%  [CPOL-RADIAL-2.5MM-5MM]
C65  100uF  10UF-POLAR-RADIAL-2.5MM-25V-20%  [CPOL-RADIAL-2.5MM-5MM]
C66  100uF  10UF-POLAR-RADIAL-2.5MM-25V-20%  [CPOL-RADIAL-2.5MM-5MM]
C67  .1uF  10NF  [CAP-PTH-5MM]
C68  .1uF  10NF  [CAP-PTH-5MM]
D24  1N4148  DIODE-KIT  [DIODE-1N4148-KIT]
D25  1N4148  DIODE-KIT  [DIODE-1N4148-KIT]
D26  1N4148  DIODE-KIT  [DIODE-1N4148-KIT]
D27  Red  LED3MM  [LED3MM]
D28  Blue  LED3MM  [LED3MM]
IC7  MEGA8-P  [DIL28-3]
PWM4  CONN_01  [1X01]
Q25  IRLI3705  MOSFET-NCH-FQP30N06L  [TO220V]
Q26  IRLI3705  MOSFET-NCH-FQP30N06L  [TO220V]
Q27  IRLI3705  MOSFET-NCH-FQP30N06L  [TO220V]
Q28  IRLI3705  MOSFET-NCH-FQP30N06L  [TO220V]
Q29  IRLI3705  MOSFET-NCH-FQP30N06L  [TO220V]
Q30  IRLI3705  MOSFET-NCH-FQP30N06L  [TO220V]
R63  10K  R-US_0207/10  [0207/10]
R64  10K  R-US_0207/10  [0207/10]
R65  10K  R-US_0207/10  [0207/10]
R66  47K  R-US_0207/10  [0207/10]
R67  47K  R-US_0207/10  [0207/10]
R68  47K  R-US_0207/10  [0207/10]
R69  47K  R-US_0207/10  [0207/10]
R70  47K  R-US_0207/10  [0207/10]
R71  47K  R-US_0207/10  [0207/10]
R72  4.7K  R-US_0207/10  [0207/10]
R73  4.7K  R-US_0207/10  [0207/10]
R74  4.7K  R-US_0207/10  [0207/10]
R75  4.7K  R-US_0207/10  [0207/10]
R76  1K  R-US_0207/10  [0207/10]
R77  47K  R-US_0207/10  [0207/10]
U13  IR2101PBF  [DIP-08]
U14  IR2101PBF  [DIP-08]
U15  IR2101PBF  [DIP-08]
X6  NC6-108-05  [SCREWTERMINAL-3.5MM-5]
Y6  ZTT-16.00MX  [SIP3-UA]

### Nets
12V: C65.1(+) C66.1(+) C67.1 C68.1 D24.A D25.A D26.A Q25.2(D) Q27.2(D) Q28.2(D) U13.1(VCC) U14.1(VCC) U15.1(VCC) X6.12V ; also sheet 2,3,4,6,7
+5V [usbvcc]: C61.1 C62.1 C63.1(+) C64.1(+) IC7.7(VCC) IC7.20(AVCC) IC7.21(AREF) R63.2 R64.1 R65.1 ; also sheet 1,2,3,4,6,7
AD4/SDA: IC7.27(PC4(ADC4/SDA)) R65.2 ; also sheet 1,2,3,4,6,7
AD5/SCL: IC7.28(PC5(ADC5/SCL)) R64.2 ; also sheet 1,2,3,4,6,7
GND [gnd]: C60.2 C61.2 C62.2 C63.2(-) C64.2(-) C65.2(-) C66.2(-) C67.2 C68.2 D27.K(C) D28.K(C) IC7.8(GND) IC7.22(GND) Q26.3(S) Q29.3(S) Q30.3(S) R72.2 R73.2 R74.2 R77.2 U13.4(COM) U14.4(COM) U15.4(COM) X6.GND Y6.2 ; also sheet 1,2,3,4,6,7
N$127: IC7.3(PD1(TXD)) U13.2(HIN)
N$128: IC7.2(PD0(RXD)) U13.3(LIN)
N$129: IC7.5(PD3(INT1)) U14.2(HIN)
N$130: IC7.4(PD2(INT0)) U14.3(LIN)
N$131: IC7.11(PD5(T1)) U15.2(HIN)
N$132: IC7.6(PD4(XCK/T0)) U15.3(LIN)
N$133: Q25.1(G) U13.7(HO)
N$134: Q26.1(G) U13.5(LO)
N$135: Q27.1(G) U14.7(HO)
N$136: Q30.1(G) U14.5(LO)
N$137: Q28.1(G) U15.7(HO)
N$138: Q29.1(G) U15.5(LO)
N$139: C58.1 D24.C U14.8(VB)
N$140: C59.1 D25.C U13.8(VB)
N$141: C57.1 D26.C U15.8(VB)
N$142: IC7.23(PC0(ADC0)) R66.2 R69.1 R74.1
N$143: IC7.24(PC1(ADC1)) R67.2 R70.1 R73.1
N$144: IC7.25(PC2(ADC2)) R68.2 R71.1 R72.1
N$145: C57.2 Q28.3(S) Q29.2(D) R68.1 U15.6(VS) X6.M3
N$146: C58.2 Q27.3(S) Q30.2(D) R67.1 U14.6(VS) X6.M2
N$147: C59.2 Q25.3(S) Q26.2(D) R66.1 U13.6(VS) X6.M1
N$148: IC7.12(PD6(AIN0)) R69.2 R70.2 R71.2
N$149: IC7.9(PB6(XTAL1/TOSC1)) Y6.1
N$150: IC7.10(PB7(XTAL2/TOSC2)) Y6.3
N$151: D27.A R75.2
N$152: D28.A R76.2
N$153: IC7.15(PB1(OC1A)) R75.1
N$154: IC7.16(PB2(SS/OC1B)) R76.1
N$155: C60.1 IC7.1(PC6(/RESET)) R63.1
N$156: IC7.14(PB0(ICP)) PWM4.1 R77.1
Unconnected: IC7.13(PD7(AIN1)) IC7.17(PB3(MOSI/OC2)) IC7.18(PB4(MISO)) IC7.19(PB5(SCK)) IC7.26(PC3(ADC3))

## Sheet 6 of 7
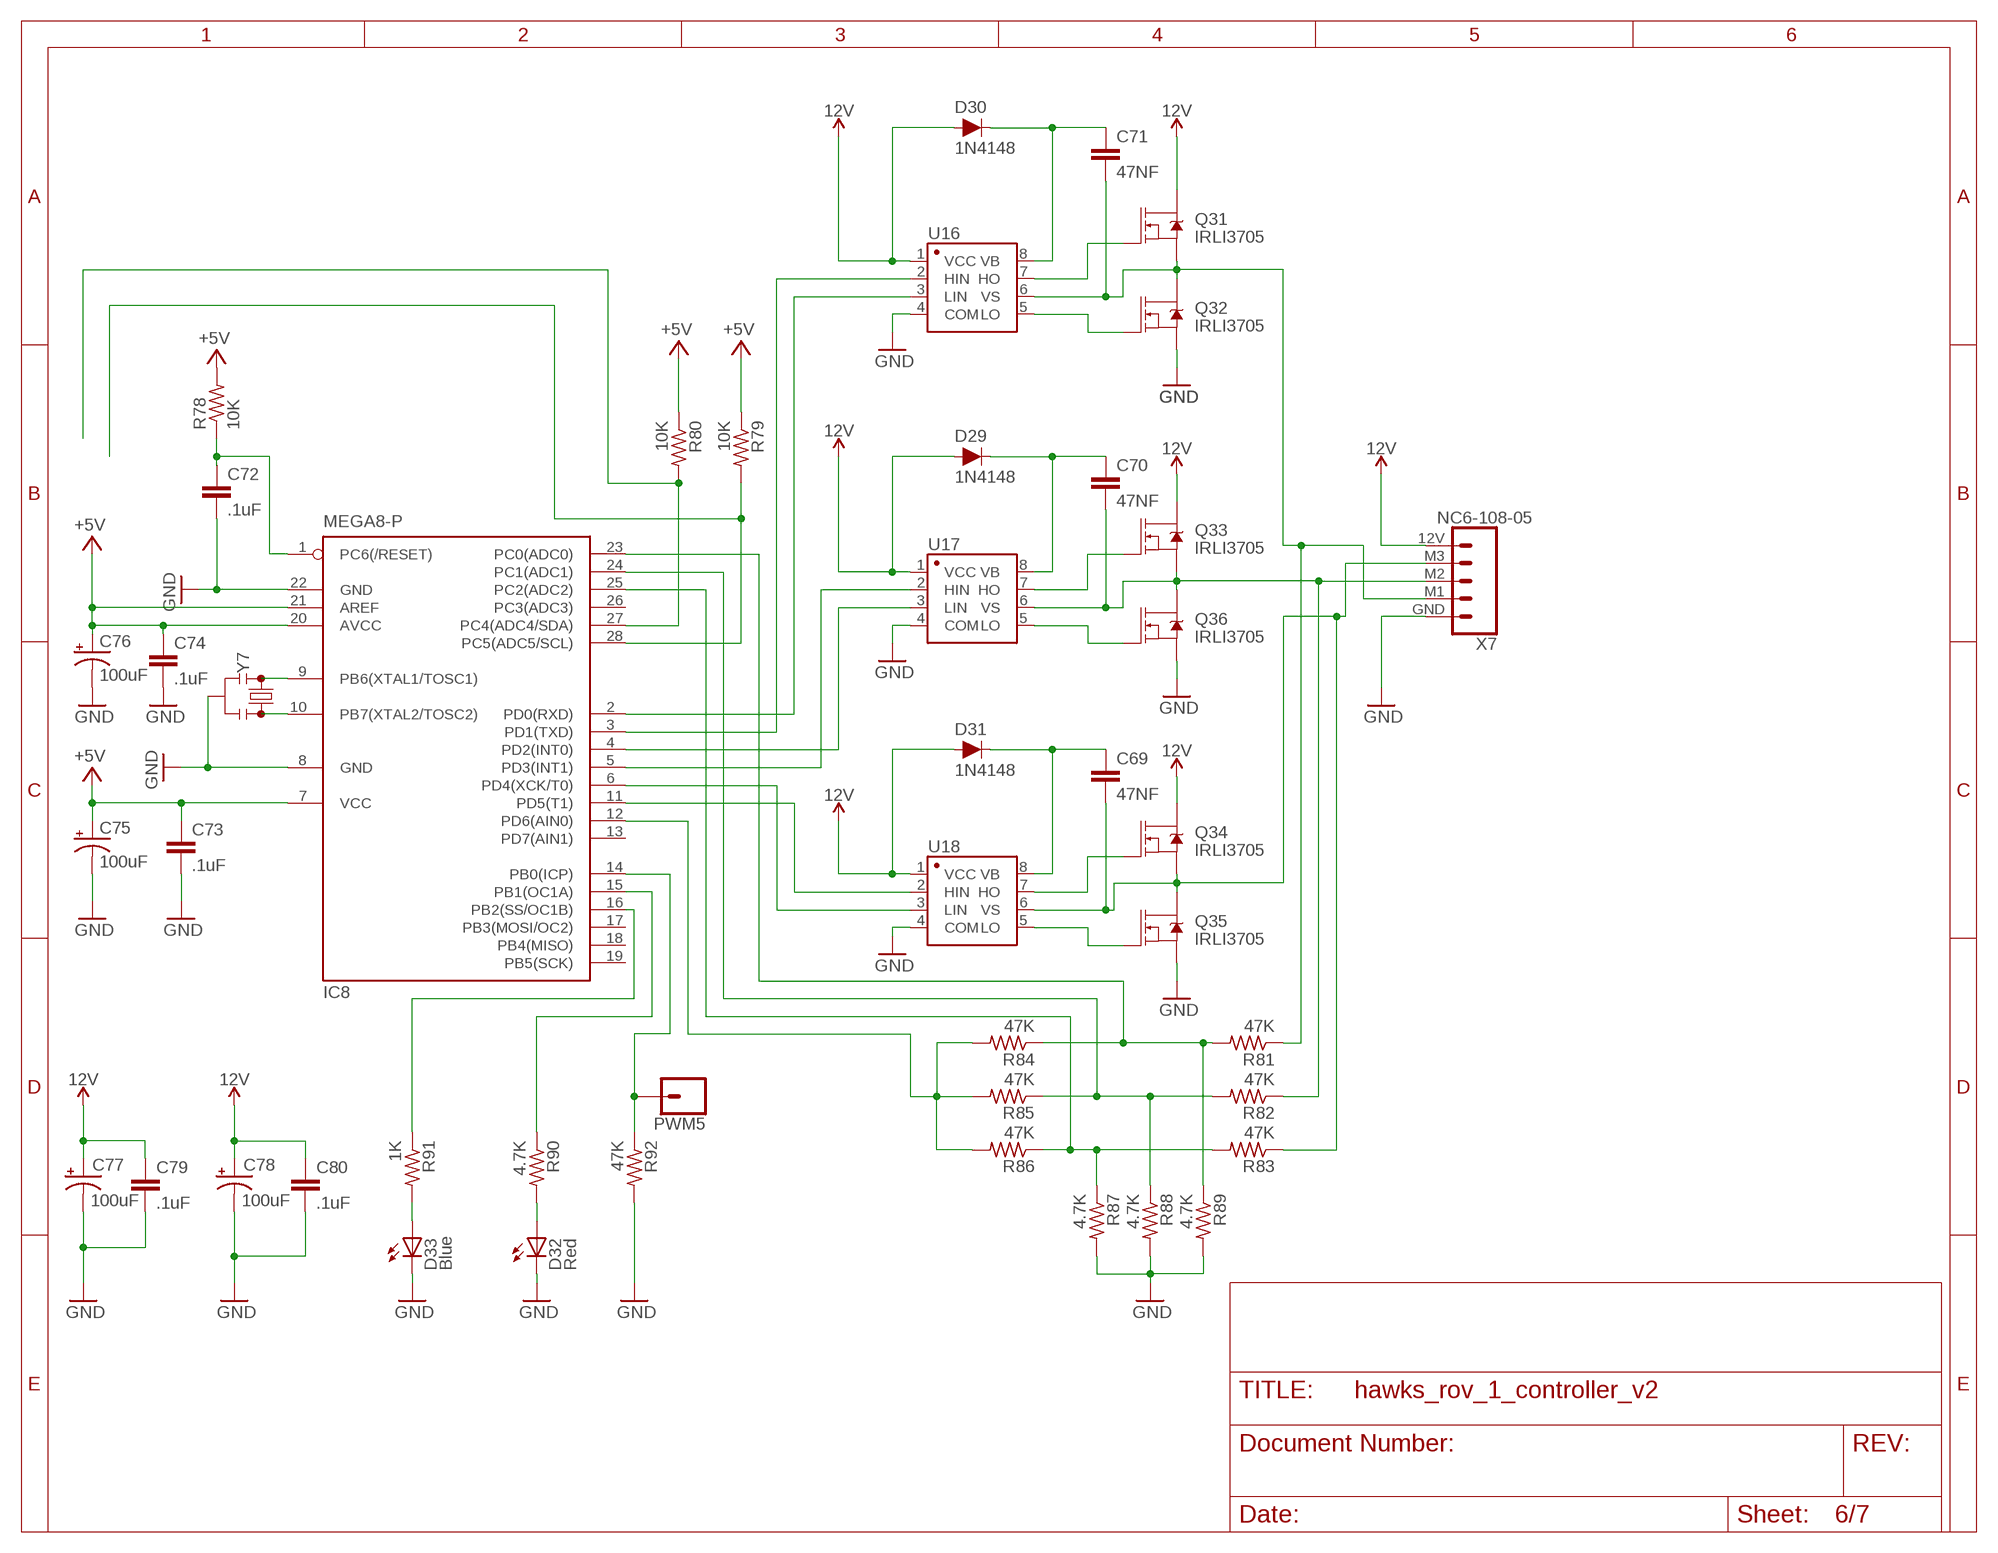
[diagram p5: schematic, sheet 6]

### Parts
C69  47NF  10NF  [CAP-PTH-5MM]
C70  47NF  10NF  [CAP-PTH-5MM]
C71  47NF  10NF  [CAP-PTH-5MM]
C72  .1uF  10NF  [CAP-PTH-5MM]
C73  .1uF  10NF  [CAP-PTH-5MM]
C74  .1uF  10NF  [CAP-PTH-5MM]
C75  100uF  10UF-POLAR-RADIAL-2.5MM-25V-20%  [CPOL-RADIAL-2.5MM-5MM]
C76  100uF  10UF-POLAR-RADIAL-2.5MM-25V-20%  [CPOL-RADIAL-2.5MM-5MM]
C77  100uF  10UF-POLAR-RADIAL-2.5MM-25V-20%  [CPOL-RADIAL-2.5MM-5MM]
C78  100uF  10UF-POLAR-RADIAL-2.5MM-25V-20%  [CPOL-RADIAL-2.5MM-5MM]
C79  .1uF  10NF  [CAP-PTH-5MM]
C80  .1uF  10NF  [CAP-PTH-5MM]
D29  1N4148  DIODE-KIT  [DIODE-1N4148-KIT]
D30  1N4148  DIODE-KIT  [DIODE-1N4148-KIT]
D31  1N4148  DIODE-KIT  [DIODE-1N4148-KIT]
D32  Red  LED3MM  [LED3MM]
D33  Blue  LED3MM  [LED3MM]
IC8  MEGA8-P  [DIL28-3]
PWM5  CONN_01  [1X01]
Q31  IRLI3705  MOSFET-NCH-FQP30N06L  [TO220V]
Q32  IRLI3705  MOSFET-NCH-FQP30N06L  [TO220V]
Q33  IRLI3705  MOSFET-NCH-FQP30N06L  [TO220V]
Q34  IRLI3705  MOSFET-NCH-FQP30N06L  [TO220V]
Q35  IRLI3705  MOSFET-NCH-FQP30N06L  [TO220V]
Q36  IRLI3705  MOSFET-NCH-FQP30N06L  [TO220V]
R78  10K  R-US_0207/10  [0207/10]
R79  10K  R-US_0207/10  [0207/10]
R80  10K  R-US_0207/10  [0207/10]
R81  47K  R-US_0207/10  [0207/10]
R82  47K  R-US_0207/10  [0207/10]
R83  47K  R-US_0207/10  [0207/10]
R84  47K  R-US_0207/10  [0207/10]
R85  47K  R-US_0207/10  [0207/10]
R86  47K  R-US_0207/10  [0207/10]
R87  4.7K  R-US_0207/10  [0207/10]
R88  4.7K  R-US_0207/10  [0207/10]
R89  4.7K  R-US_0207/10  [0207/10]
R90  4.7K  R-US_0207/10  [0207/10]
R91  1K  R-US_0207/10  [0207/10]
R92  47K  R-US_0207/10  [0207/10]
U16  IR2101PBF  [DIP-08]
U17  IR2101PBF  [DIP-08]
U18  IR2101PBF  [DIP-08]
X7  NC6-108-05  [SCREWTERMINAL-3.5MM-5]
Y7  ZTT-16.00MX  [SIP3-UA]

### Nets
12V: C77.1(+) C78.1(+) C79.1 C80.1 D29.A D30.A D31.A Q31.2(D) Q33.2(D) Q34.2(D) U16.1(VCC) U17.1(VCC) U18.1(VCC) X7.12V ; also sheet 2,3,4,5,7
+5V [usbvcc]: C73.1 C74.1 C75.1(+) C76.1(+) IC8.7(VCC) IC8.20(AVCC) IC8.21(AREF) R78.2 R79.1 R80.1 ; also sheet 1,2,3,4,5,7
AD4/SDA: IC8.27(PC4(ADC4/SDA)) R80.2 ; also sheet 1,2,3,4,5,7
AD5/SCL: IC8.28(PC5(ADC5/SCL)) R79.2 ; also sheet 1,2,3,4,5,7
GND [gnd]: C72.2 C73.2 C74.2 C75.2(-) C76.2(-) C77.2(-) C78.2(-) C79.2 C80.2 D32.K(C) D33.K(C) IC8.8(GND) IC8.22(GND) Q32.3(S) Q35.3(S) Q36.3(S) R87.2 R88.2 R89.2 R92.2 U16.4(COM) U17.4(COM) U18.4(COM) X7.GND Y7.2 ; also sheet 1,2,3,4,5,7
N$157: IC8.3(PD1(TXD)) U16.2(HIN)
N$158: IC8.2(PD0(RXD)) U16.3(LIN)
N$159: IC8.5(PD3(INT1)) U17.2(HIN)
N$160: IC8.4(PD2(INT0)) U17.3(LIN)
N$161: IC8.11(PD5(T1)) U18.2(HIN)
N$162: IC8.6(PD4(XCK/T0)) U18.3(LIN)
N$163: Q31.1(G) U16.7(HO)
N$164: Q32.1(G) U16.5(LO)
N$165: Q33.1(G) U17.7(HO)
N$166: Q36.1(G) U17.5(LO)
N$167: Q34.1(G) U18.7(HO)
N$168: Q35.1(G) U18.5(LO)
N$169: C70.1 D29.C U17.8(VB)
N$170: C71.1 D30.C U16.8(VB)
N$171: C69.1 D31.C U18.8(VB)
N$172: IC8.23(PC0(ADC0)) R81.2 R84.1 R89.1
N$173: IC8.24(PC1(ADC1)) R82.2 R85.1 R88.1
N$174: IC8.25(PC2(ADC2)) R83.2 R86.1 R87.1
N$175: C69.2 Q34.3(S) Q35.2(D) R83.1 U18.6(VS) X7.M3
N$176: C70.2 Q33.3(S) Q36.2(D) R82.1 U17.6(VS) X7.M2
N$177: C71.2 Q31.3(S) Q32.2(D) R81.1 U16.6(VS) X7.M1
N$178: IC8.12(PD6(AIN0)) R84.2 R85.2 R86.2
N$179: IC8.9(PB6(XTAL1/TOSC1)) Y7.1
N$180: IC8.10(PB7(XTAL2/TOSC2)) Y7.3
N$181: D32.A R90.2
N$182: D33.A R91.2
N$183: IC8.15(PB1(OC1A)) R90.1
N$184: IC8.16(PB2(SS/OC1B)) R91.1
N$185: C72.1 IC8.1(PC6(/RESET)) R78.1
N$186: IC8.14(PB0(ICP)) PWM5.1 R92.1
Unconnected: IC8.13(PD7(AIN1)) IC8.17(PB3(MOSI/OC2)) IC8.18(PB4(MISO)) IC8.19(PB5(SCK)) IC8.26(PC3(ADC3))

## Sheet 7 of 7
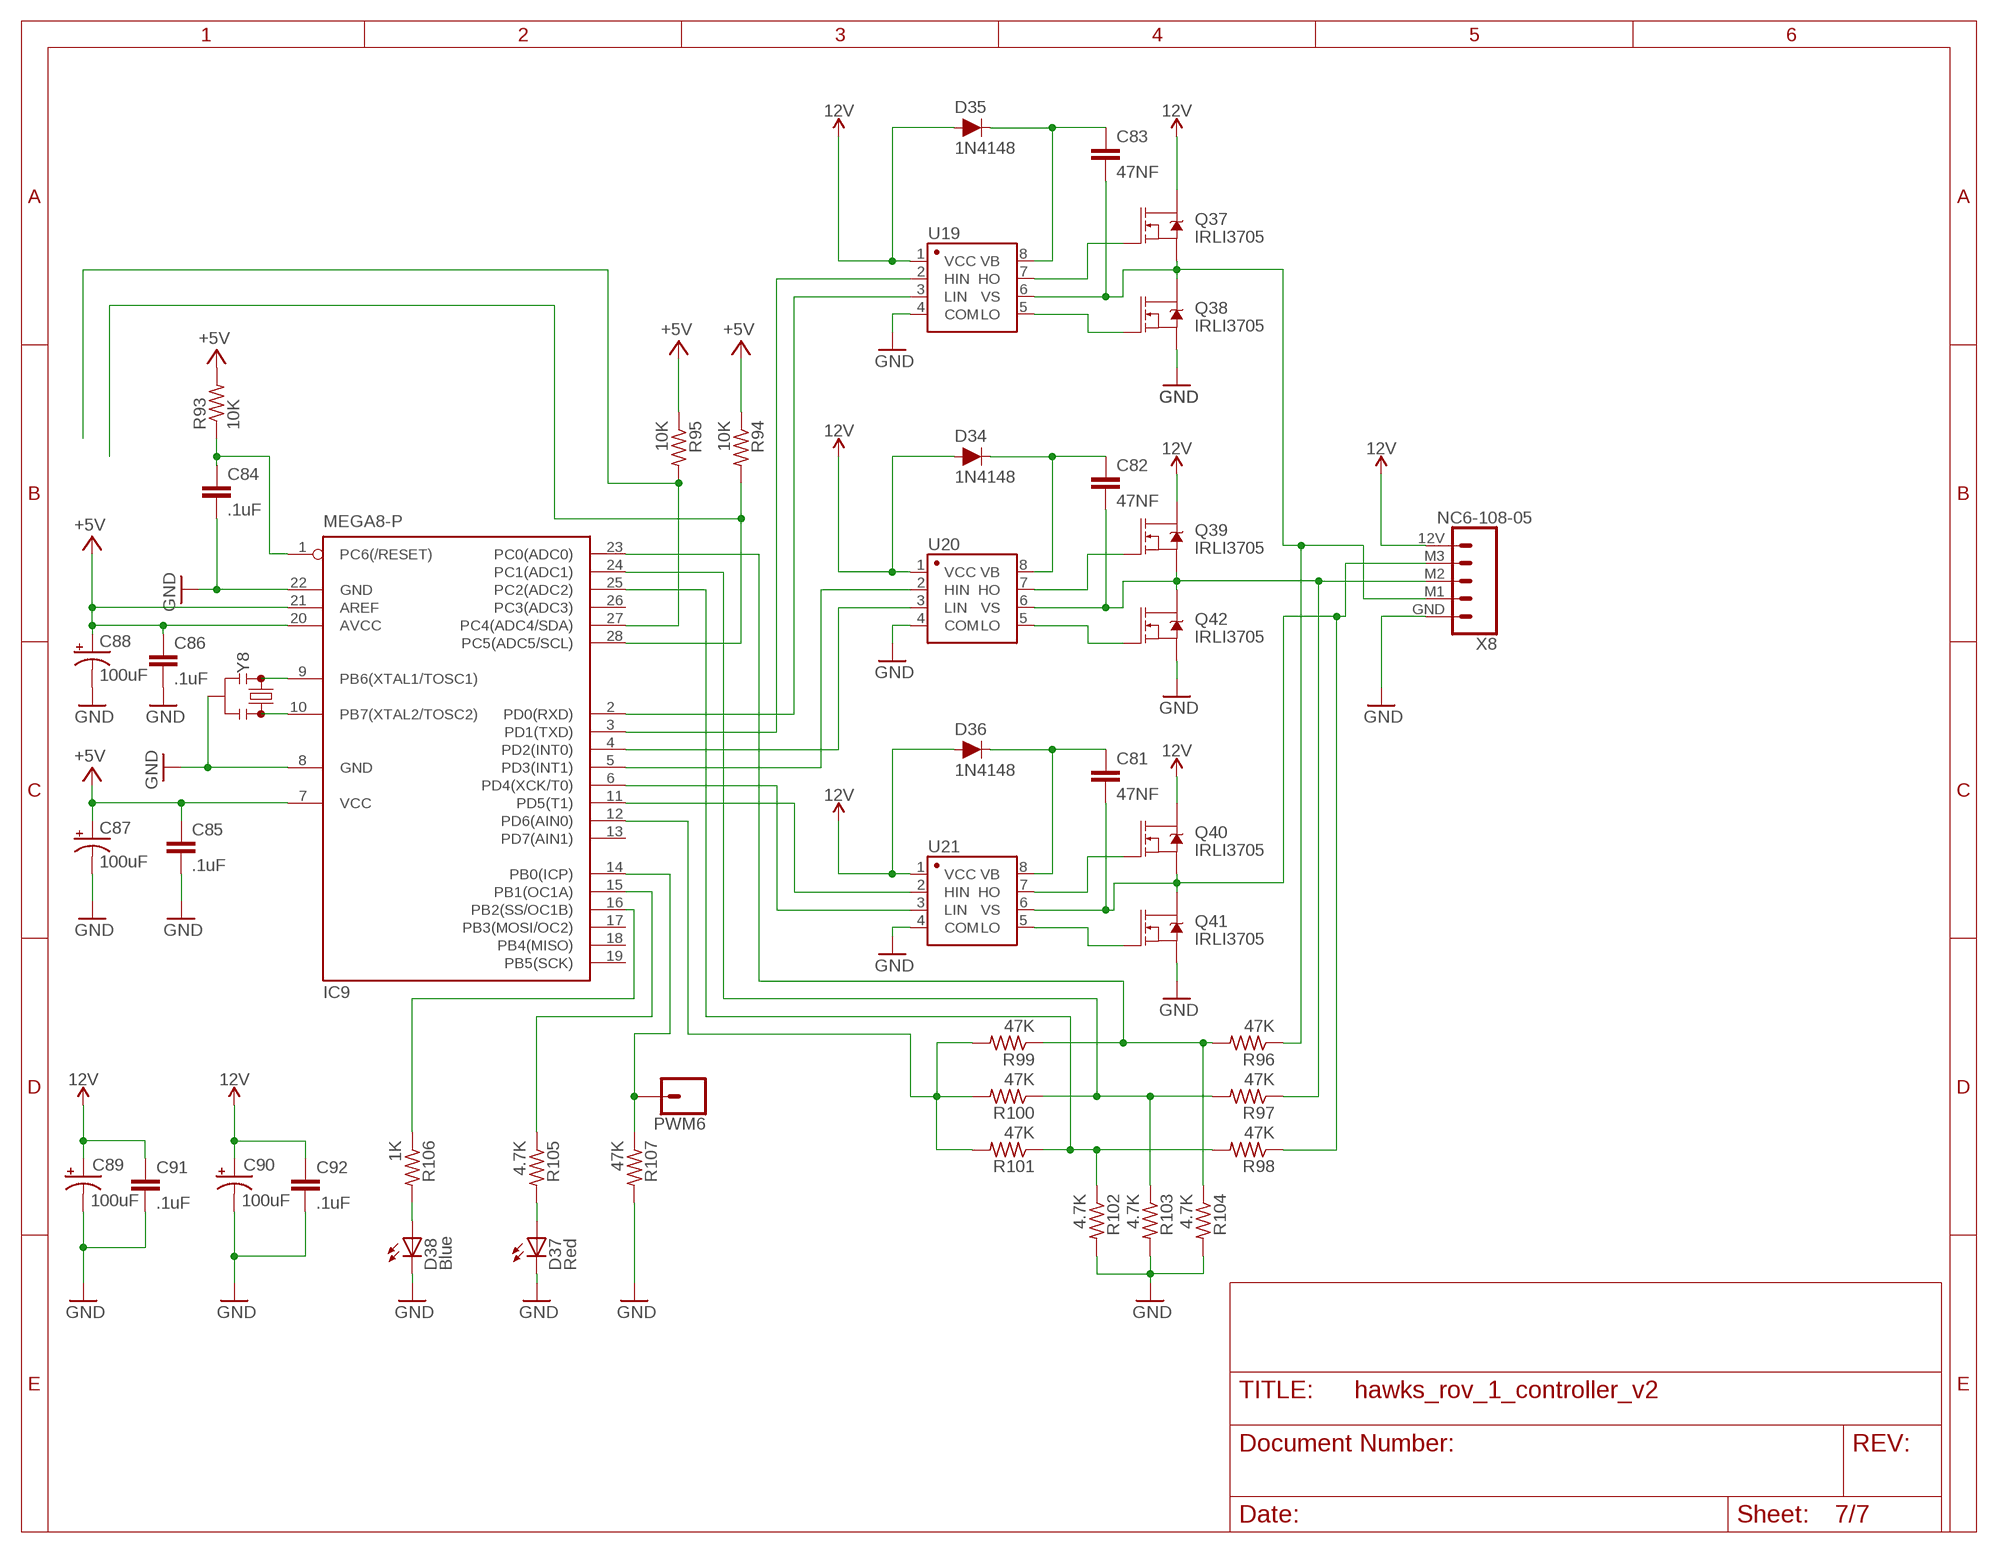
[diagram p6: schematic, sheet 7]

### Parts
C81  47NF  10NF  [CAP-PTH-5MM]
C82  47NF  10NF  [CAP-PTH-5MM]
C83  47NF  10NF  [CAP-PTH-5MM]
C84  .1uF  10NF  [CAP-PTH-5MM]
C85  .1uF  10NF  [CAP-PTH-5MM]
C86  .1uF  10NF  [CAP-PTH-5MM]
C87  100uF  10UF-POLAR-RADIAL-2.5MM-25V-20%  [CPOL-RADIAL-2.5MM-5MM]
C88  100uF  10UF-POLAR-RADIAL-2.5MM-25V-20%  [CPOL-RADIAL-2.5MM-5MM]
C89  100uF  10UF-POLAR-RADIAL-2.5MM-25V-20%  [CPOL-RADIAL-2.5MM-5MM]
C90  100uF  10UF-POLAR-RADIAL-2.5MM-25V-20%  [CPOL-RADIAL-2.5MM-5MM]
C91  .1uF  10NF  [CAP-PTH-5MM]
C92  .1uF  10NF  [CAP-PTH-5MM]
D34  1N4148  DIODE-KIT  [DIODE-1N4148-KIT]
D35  1N4148  DIODE-KIT  [DIODE-1N4148-KIT]
D36  1N4148  DIODE-KIT  [DIODE-1N4148-KIT]
D37  Red  LED3MM  [LED3MM]
D38  Blue  LED3MM  [LED3MM]
IC9  MEGA8-P  [DIL28-3]
PWM6  CONN_01  [1X01]
Q37  IRLI3705  MOSFET-NCH-FQP30N06L  [TO220V]
Q38  IRLI3705  MOSFET-NCH-FQP30N06L  [TO220V]
Q39  IRLI3705  MOSFET-NCH-FQP30N06L  [TO220V]
Q40  IRLI3705  MOSFET-NCH-FQP30N06L  [TO220V]
Q41  IRLI3705  MOSFET-NCH-FQP30N06L  [TO220V]
Q42  IRLI3705  MOSFET-NCH-FQP30N06L  [TO220V]
R93  10K  R-US_0207/10  [0207/10]
R94  10K  R-US_0207/10  [0207/10]
R95  10K  R-US_0207/10  [0207/10]
R96  47K  R-US_0207/10  [0207/10]
R97  47K  R-US_0207/10  [0207/10]
R98  47K  R-US_0207/10  [0207/10]
R99  47K  R-US_0207/10  [0207/10]
R100  47K  R-US_0207/10  [0207/10]
R101  47K  R-US_0207/10  [0207/10]
R102  4.7K  R-US_0207/10  [0207/10]
R103  4.7K  R-US_0207/10  [0207/10]
R104  4.7K  R-US_0207/10  [0207/10]
R105  4.7K  R-US_0207/10  [0207/10]
R106  1K  R-US_0207/10  [0207/10]
R107  47K  R-US_0207/10  [0207/10]
U19  IR2101PBF  [DIP-08]
U20  IR2101PBF  [DIP-08]
U21  IR2101PBF  [DIP-08]
X8  NC6-108-05  [SCREWTERMINAL-3.5MM-5]
Y8  ZTT-16.00MX  [SIP3-UA]

### Nets
12V: C89.1(+) C90.1(+) C91.1 C92.1 D34.A D35.A D36.A Q37.2(D) Q39.2(D) Q40.2(D) U19.1(VCC) U20.1(VCC) U21.1(VCC) X8.12V ; also sheet 2,3,4,5,6
+5V [usbvcc]: C85.1 C86.1 C87.1(+) C88.1(+) IC9.7(VCC) IC9.20(AVCC) IC9.21(AREF) R93.2 R94.1 R95.1 ; also sheet 1,2,3,4,5,6
AD4/SDA: IC9.27(PC4(ADC4/SDA)) R95.2 ; also sheet 1,2,3,4,5,6
AD5/SCL: IC9.28(PC5(ADC5/SCL)) R94.2 ; also sheet 1,2,3,4,5,6
GND [gnd]: C84.2 C85.2 C86.2 C87.2(-) C88.2(-) C89.2(-) C90.2(-) C91.2 C92.2 D37.K(C) D38.K(C) IC9.8(GND) IC9.22(GND) Q38.3(S) Q41.3(S) Q42.3(S) R102.2 R103.2 R104.2 R107.2 U19.4(COM) U20.4(COM) U21.4(COM) X8.GND Y8.2 ; also sheet 1,2,3,4,5,6
N$187: IC9.3(PD1(TXD)) U19.2(HIN)
N$188: IC9.2(PD0(RXD)) U19.3(LIN)
N$189: IC9.5(PD3(INT1)) U20.2(HIN)
N$190: IC9.4(PD2(INT0)) U20.3(LIN)
N$191: IC9.11(PD5(T1)) U21.2(HIN)
N$192: IC9.6(PD4(XCK/T0)) U21.3(LIN)
N$193: Q37.1(G) U19.7(HO)
N$194: Q38.1(G) U19.5(LO)
N$195: Q39.1(G) U20.7(HO)
N$196: Q42.1(G) U20.5(LO)
N$197: Q40.1(G) U21.7(HO)
N$198: Q41.1(G) U21.5(LO)
N$199: C82.1 D34.C U20.8(VB)
N$200: C83.1 D35.C U19.8(VB)
N$201: C81.1 D36.C U21.8(VB)
N$202: IC9.23(PC0(ADC0)) R96.2 R99.1 R104.1
N$203: IC9.24(PC1(ADC1)) R97.2 R100.1 R103.1
N$204: IC9.25(PC2(ADC2)) R98.2 R101.1 R102.1
N$205: C81.2 Q40.3(S) Q41.2(D) R98.1 U21.6(VS) X8.M3
N$206: C82.2 Q39.3(S) Q42.2(D) R97.1 U20.6(VS) X8.M2
N$207: C83.2 Q37.3(S) Q38.2(D) R96.1 U19.6(VS) X8.M1
N$208: IC9.12(PD6(AIN0)) R99.2 R100.2 R101.2
N$209: IC9.9(PB6(XTAL1/TOSC1)) Y8.1
N$210: IC9.10(PB7(XTAL2/TOSC2)) Y8.3
N$211: D37.A R105.2
N$212: D38.A R106.2
N$213: IC9.15(PB1(OC1A)) R105.1
N$214: IC9.16(PB2(SS/OC1B)) R106.1
N$215: C84.1 IC9.1(PC6(/RESET)) R93.1
N$216: IC9.14(PB0(ICP)) PWM6.1 R107.1
Unconnected: IC9.13(PD7(AIN1)) IC9.17(PB3(MOSI/OC2)) IC9.18(PB4(MISO)) IC9.19(PB5(SCK)) IC9.26(PC3(ADC3))

## Library data of the parts
AD = SmartPrj:PINHD-1X6: PIN HEADER
C1 C4 C5 C10 C21-C26 C31-C38 C43-C50 C55-C62 C67-C74 C79-C86 C91 C92 = SparkFun-Capacitors:10NF: 0.01uF/10nF/10,000pF ceramic capacitors A capacitor is a passive two-terminal electrical component used to store electrical energy temporarily in an electric field. CAP-09321
C12 C13 C15 C16 C27-C30 C39-C42 C51-C54 C63-C66 C75-C78 C87-C90 = SparkFun-Capacitors:10UF-POLAR: 10.0µF polarized capacitors A capacitor is a passive two-terminal electrical component used to store electrical energy temporarily in an electric field.; PROD_ID: CAP-08440; VALUE: 10uF
D1 D8-D11 D14-D16 D19-D21 D24-D26 D29-D31 D34-D36 = SparkFun-DiscreteSemi:DIODE: Diode These are standard reverse protection diodes and small signal diodes. SparkFun Products: SparkFun SparkPunk Sound Kit <https://www.sparkfun.com/products/11177> SparkFun ESP8266 Thing <https://www.sparkfun.com/products/13231>; PROD_ID: DIO-08378; VALUE: 200mA/100V/1V
D2 D12 D13 D17 D18 D22 D23 D27 D28 D32 D33 D37 D38 = led:LED: LED OSRAM: - CHIPLED LG R971, LG N971, LY N971, LG Q971, LY Q971, LO R971, LY R971 LH N974, LH R974 LS Q976, LO Q976, LY Q976 LO Q996 - Hyper CHIPLED LW Q18S LB Q993, LB Q99A, LB R99A - SideLED LS A670, LO A670, LY A670, LG A670, LP A670 LB A673, LV A673, LT A673, LW A673 LH A674 LY A675 LS A676, LA A676, LO A676, LY A676, LW A676 LS A679, LY A679, LG A679 - Hyper Micro SIDELED® LS Y876, LA Y876, LO Y876, LY Y876 LT Y87S - SmartLED LW L88C, LW L88S LB L89C, LB L89S, LG L890 LS L89K, LO L89K, LY L89K LS L896, LA L896, LO L896, LY L896 - TOPLED LS T670, LO T670, LY T670, LG T670, LP T670 LSG T670, LSP T670, LSY T670, LOP T670, LYG T670 LG T671, LOG T671, LSG T671 LB T673, LV T673, LT T673, LW T673 LH T674 LS T676, LA T676, LO T676, LY T676, LB T676, LH T676, LSB T676, LW T676 LB T67C, LV T67C, LT T67C, LS T67K, LO T67K, LY T67K, LW E67C LS E67B, LA E67B, LO E67B, LY E67B, LB E67C, LV E67C, LT E67C LW T67C LS T679, LY T679, LG T679 LS T770, LO T770, LY T770, LG T770, LP T770 LB T773, LV T773, LT T773, LW T773 LH T774 LS E675, LA E675, LY E675, LS T675 LS T776, LA T776, LO T776, LY T776, LB T776 LHGB T686 LT T68C, LB T68C - Hyper Mini TOPLED® LB M676 - Mini TOPLED Santana® LG M470 LS M47K, LO M47K, LY M47K Source: http://www.osram.convergy.de LUXEON: - LUMILED® LXK2-PW12-R00, LXK2-PW12-S00, LXK2-PW14-U00, LXK2-PW14-V00 LXK2-PM12-R00, LXK2-PM12-S00, LXK2-PM14-U00 LXK2-PE12-Q00, LXK2-PE12-R00, LXK2-PE12-S00, LXK2-PE14-T00, LXK2-PE14-U00 LXK2-PB12-K00, LXK2-PB12-L00, LXK2-PB12-M00, LXK2-PB14-N00, LXK2-PB14-P00, LXK2-PB14-Q00 LXK2-PR12-L00, LXK2-PR12-M00, LXK2-PR14-Q00, LXK2-PR14-R00 LXK2-PD12-Q00, LXK2-PD12-R00, LXK2-PD12-S00 LXK2-PH12-R00, LXK2-PH12-S00 LXK2-PL12-P00, LXK2-PL12-Q00, LXK2-PL12-R00 Source: www.luxeon.com KINGBRIGHT: KA-3528ASYC Source: www.kingbright.com
IC1 = Wiz820io:WIZ820IO_DEVICE: WIZnet, WIZ820io plug in module incl. W5200 chip and MagJack
IC2 IC5-IC9 = atmel:MEGA8-P: MICROCONTROLLER 8 Kbytes FLASH, 1 kbytes SRAM, 512 bytes EEPROM, USART, 4-channel 10 bit ADC, 2-channel 8 bit ADC Pin compatible with Atmega48, ATMega88, ATMega168 Source: avr.lbr; OC_FARNELL: unknown; OC_NEWARK: unknown
IC4 = v-reg:LD117A?*: Low drop fixed and adjustable positive voltage regulators 1 A Source: http://www.st.com/stonline/products/literature/ds/7194/ld1117axx.pdf
ICSP = SmartPrj:PINHD-2X3: PIN HEADER
IOH = SmartPrj:PINHD-1X10_ARD: PIN HEADER
IOL POWER = SmartPrj:PINHD-1X8: PIN HEADER
MIC29510-5.0WT = infineon:MIC29510-5.0WT: MIC29510-5.0WT; DEVICE: IC2
PWM1-PWM6 = SparkFun-Connectors:CONN_01: Single connection point. Often used as Generic Header-pin footprint for 0.1 inch spaced/style header connections On any of the 0.1 inch spaced packages, you can populate with these: Break Away Headers - Straight <https://www.sparkfun.com/products/116> (PRT-00116) Break Away Male Headers - Right Angle <https://www.sparkfun.com/products/553> (PRT-00553) Female Headers <https://www.sparkfun.com/products/115> (PRT-00115) Break Away Headers - Machine Pin <https://www.sparkfun.com/products/117> (PRT-00117) Break Away Female Headers - Swiss Machine Pin <https://www.sparkfun.com/products/743> (PRT-00743) This device is also useful as a general connection point to wire up your design to another part of your project. Our various solder wires solder well into these plated through hole pads. Hook-Up Wire - Assortment (Stranded, 22 AWG) <https://www.sparkfun.com/products/11375> (PRT-11375) Hook-Up Wire - Assortment (Solid Core, 22 AWG) <https://www.sparkfun.com/products/11367> (PRT-11367) View the entire wire category on our website here <https://www.sparkfun.com/categories/141> Special notes: SMTSO-256-ET is a "flush mount" nut for a 4-40 screw. We mostly use this on specialty testbeds; it is a nice way to connect hardware to your PCB at an adjustable hieght. Also note, the SNAP packages are for using a snappable style connector. We sell a baggie of snaps and they are also used on two LilyPad designs: Snap Assortment - 30 pack (male and female) <https://www.sparkfun.com/products/11347> (DEV-11347) LilyPad Arduino SimpleSnap <https://www.sparkfun.com/products/10941> (DEV-10941) LilyPad SimpleSnap Protoboard <https://www.sparkfun.com/products/10940> (DEV-10940)
Q7-Q42 = SparkFun-DiscreteSemi:MOSFET-NCH: N-channel MOSFETs Voltage controlled devices that allow control of high current outputs. SparkFun Products: SparkFun OpenScale <https://www.sparkfun.com/products/13261> SparkFun Digital Sandbox <https://www.sparkfun.com/products/12651> SparkFun Monster Moto Shield <https://www.sparkfun.com/products/10182> SparkFun MOSFET Power Controller <https://www.sparkfun.com/products/11214>; PROD_ID: TRANS-10060; VALUE: 60V/32A/35mΩ
R2 R17-R107 = resistor:R-US_: RESISTOR, American symbol
U1 U5-U21 = infineon:IR2101PBF
X1 X3-X8 = infineon:NC6-108-05
Y2-Y8 = infineon:ZTT-16.00MX
ZU4 = SmartPrj:ATMEGA328P-: MICROCONTROLLER 4 Kbytes FLASH 128 bytes SRAM 256 bytes EEPROM UART 6-channel 10 bit ADC

## Net classes
0 default: width 0.254 mm, clearance 0.254 mm
1 power: width 0.61 mm, drill 0.61 mm, clearance 0.254 mm
2 gnd: width 0.305 mm, drill 0.559 mm, clearance 0.254 mm
3 usbvcc: width 0.508 mm, drill 0.61 mm, clearance 0.254 mm
4 aref: width 0.406 mm, drill 0.61 mm, clearance 0.254 mm